# Altium project PBL4_2026L_runIT.PrjPcb (part 1 of 2)
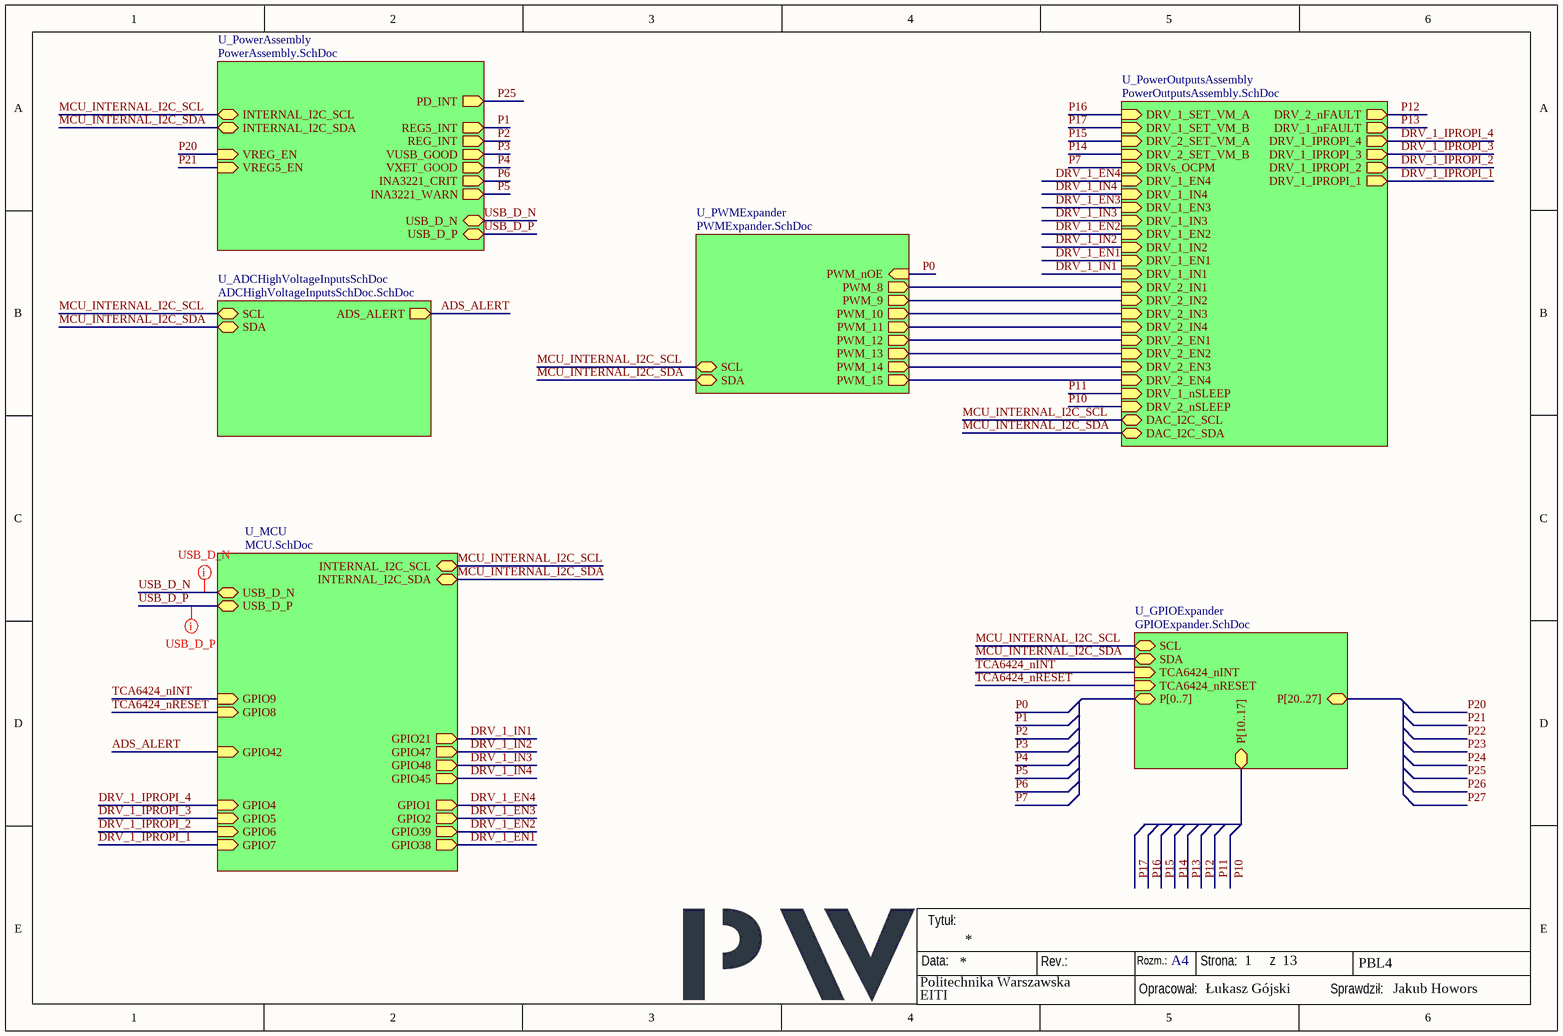
[diagram p0: MainAssembly.SchDoc]
projGroupName: grupa 3; projLocalName: runIT; projRevision: 1.0
13 sheets, 308 parts. Net scope: hierarchical (ports join the sheet entries above them; power ports are global).
Board file: PCB.PcbDoc
Sheets:
  MainAssembly.SchDoc
    U_PowerAssembly = PowerAssembly.SchDoc
      U_DCDC3 = DCDC3.SchDoc
      Reg = DCDCreg.SchDoc
      U_USBPD = USBPD.SchDoc
      Reg5 = DCDCreg.SchDoc
    U_PowerOutputsAssembly = PowerOutputsAssembly.SchDoc
      U_MuxVM_1 = MuxVM.SchDoc
      U_MuxVM_2 = MuxVM.SchDoc
      DRV1 = DRVPowerOutputs.SchDoc
      DRV2 = DRVPowerOutputs.SchDoc
      U_DAC = DAC.SchDoc
    U_PWMExpander = PWMExpander.SchDoc
    U_MCU = MCU.SchDoc
    U_ADCHighVoltageInputsSchDoc = ADCHighVoltageInputsSchDoc.SchDoc
    U_GPIOExpander = GPIOExpander.SchDoc

## Sheet MainAssembly.SchDoc
size 292 x 193 mm; CheckedBy: Jakub Howors; Author: Łukasz Gójski; CompanyName: Politechnika Warszawska; Organization: EITI; Address1: Nowowiejska 15/19; Address2: 00-665 Warszawa; Revision: 1.0; SheetNumber: 1; SheetTotal: 13; HTTPLink: www.pw.edu.pl; Group_Name: grupa 3; ProjName: runIT

### Sub-sheets
U_ADCHighVoltageInputsSchDoc = ADCHighVoltageInputsSchDoc.SchDoc: ADS_ALERT (out), SCL (bidir), SDA (bidir)
U_GPIOExpander = GPIOExpander.SchDoc: TCA6424_nINT (in), TCA6424_nRESET (in), P[0..7] (bidir), P[10..17] (bidir), P[20..27] (bidir), SCL (bidir), SDA (bidir)
U_MCU = MCU.SchDoc: INTERNAL_I2C_SCL (bidir), INTERNAL_I2C_SDA (bidir), GPIO2 (out), GPIO4 (in), GPIO5 (in), GPIO6 (in), GPIO7 (in), GPIO8 (in), GPIO21 (out), GPIO38 (out), GPIO47 (out), GPIO48 (out), GPIO45 (out), GPIO39 (out), USB_D_N (bidir), USB_D_P (bidir), GPIO1 (out), GPIO42 (in), GPIO9 (in)
U_PowerAssembly = PowerAssembly.SchDoc: REG5_INT (out), REG_INT (out), VUSB_GOOD (out), VXET_GOOD (out), INA3221_CRIT (out), INA3221_WARN (out), INTERNAL_I2C_SDA (bidir), INTERNAL_I2C_SCL (bidir), VREG_EN (in), VREG5_EN (in), USB_D_N (bidir), USB_D_P (bidir), PD_INT (out)
U_PowerOutputsAssembly = PowerOutputsAssembly.SchDoc: DRV_2_nFAULT (out), DRV_1_nFAULT (out), DRV_1_IPROPI_4 (out), DRV_1_IPROPI_3 (out), DRV_1_IPROPI_2 (out), DRV_1_IPROPI_1 (out), DRV_1_SET_VM_A (in), DRV_1_SET_VM_B (in), DRV_2_SET_VM_A (in), DRV_2_SET_VM_B (in), DRVs_OCPM (in), DRV_1_EN4 (in), DRV_1_IN4 (in), DRV_1_EN3 (in), DRV_1_IN3 (in), DRV_1_EN2 (in), DRV_1_IN2 (in), DRV_1_EN1 (in), DRV_1_IN1 (in), DRV_2_EN4 (in), DRV_2_IN4 (in), DRV_2_EN3 (in), DRV_2_IN3 (in), DRV_2_EN2 (in), DRV_2_IN2 (in), DRV_2_EN1 (in), DRV_2_IN1 (in), DRV_1_nSLEEP (in), DRV_2_nSLEEP (in), DAC_I2C_SCL (bidir), DAC_I2C_SDA (bidir)
U_PWMExpander = PWMExpander.SchDoc: SDA (bidir), SCL (bidir), PWM_nOE (in), PWM_8 (out), PWM_9 (out), PWM_10 (out), PWM_11 (out), PWM_12 (out), PWM_13 (out), PWM_14 (out), PWM_15 (out)

### Nets
ADS_ALERT: sheet U_MCU/GPIO42, sheet U_ADCHighVoltageInputsSchDoc/ADS_ALERT
DRV_1_EN1: sheet U_PowerOutputsAssembly/DRV_1_EN1, sheet U_MCU/GPIO38
DRV_1_EN2: sheet U_PowerOutputsAssembly/DRV_1_EN2, sheet U_MCU/GPIO39
DRV_1_EN3: sheet U_PowerOutputsAssembly/DRV_1_EN3, sheet U_MCU/GPIO2
DRV_1_EN4: sheet U_PowerOutputsAssembly/DRV_1_EN4, sheet U_MCU/GPIO1
DRV_1_IN1: sheet U_PowerOutputsAssembly/DRV_1_IN1, sheet U_MCU/GPIO21
DRV_1_IN2: sheet U_PowerOutputsAssembly/DRV_1_IN2, sheet U_MCU/GPIO47
DRV_1_IN3: sheet U_PowerOutputsAssembly/DRV_1_IN3, sheet U_MCU/GPIO48
DRV_1_IN4: sheet U_PowerOutputsAssembly/DRV_1_IN4, sheet U_MCU/GPIO45
DRV_1_IPROPI_1: sheet U_PowerOutputsAssembly/DRV_1_IPROPI_1, sheet U_MCU/GPIO7
DRV_1_IPROPI_2: sheet U_PowerOutputsAssembly/DRV_1_IPROPI_2, sheet U_MCU/GPIO6
DRV_1_IPROPI_3: sheet U_PowerOutputsAssembly/DRV_1_IPROPI_3, sheet U_MCU/GPIO5
DRV_1_IPROPI_4: sheet U_PowerOutputsAssembly/DRV_1_IPROPI_4, sheet U_MCU/GPIO4
DRV_2_EN1: sheet U_PowerOutputsAssembly/DRV_2_EN1, sheet U_PWMExpander/PWM_12
DRV_2_EN2: sheet U_PowerOutputsAssembly/DRV_2_EN2, sheet U_PWMExpander/PWM_13
DRV_2_EN3: sheet U_PowerOutputsAssembly/DRV_2_EN3, sheet U_PWMExpander/PWM_14
DRV_2_EN4: sheet U_PowerOutputsAssembly/DRV_2_EN4, sheet U_PWMExpander/PWM_15
DRV_2_IN1: sheet U_PowerOutputsAssembly/DRV_2_IN1, sheet U_PWMExpander/PWM_8
DRV_2_IN2: sheet U_PowerOutputsAssembly/DRV_2_IN2, sheet U_PWMExpander/PWM_9
DRV_2_IN3: sheet U_PowerOutputsAssembly/DRV_2_IN3, sheet U_PWMExpander/PWM_10
DRV_2_IN4: sheet U_PowerOutputsAssembly/DRV_2_IN4, sheet U_PWMExpander/PWM_11
MCU_INTERNAL_I2C_SCL: sheet U_PowerAssembly/INTERNAL_I2C_SCL, sheet U_PowerOutputsAssembly/DAC_I2C_SCL, sheet U_PWMExpander/SCL, sheet U_MCU/INTERNAL_I2C_SCL, sheet U_ADCHighVoltageInputsSchDoc/SCL, sheet U_GPIOExpander/SCL  [project net INTERNAL_I2C_SCL]
MCU_INTERNAL_I2C_SDA: sheet U_PowerAssembly/INTERNAL_I2C_SDA, sheet U_PowerOutputsAssembly/DAC_I2C_SDA, sheet U_PWMExpander/SDA, sheet U_MCU/INTERNAL_I2C_SDA, sheet U_ADCHighVoltageInputsSchDoc/SDA, sheet U_GPIOExpander/SDA  [project net INTERNAL_I2C_SDA]
TCA6424_nINT: sheet U_MCU/GPIO9, sheet U_GPIOExpander/TCA6424_nINT
TCA6424_nRESET: sheet U_MCU/GPIO8, sheet U_GPIOExpander/TCA6424_nRESET
USB_D_N: sheet U_PowerAssembly/USB_D_N, sheet U_MCU/USB_D_N
USB_D_P: sheet U_PowerAssembly/USB_D_P, sheet U_MCU/USB_D_P

### Layout directives
differential pair: USB_D_N, USB_D_P

### Notes on the sheet
- Data:
- Tytuł:
- Rev.:
- Rozm.:
- A4
- Strona:
- z
- PBL4
- Opracował:
- Sprawdził:

## Sheet PowerAssembly.SchDoc: Board Power Assembly
size 292 x 193 mm; CheckedBy: Jakub Howorus; Author: Łukasz Gójski; CompanyName: Politechnika Warszawska; DrawnBy: Łukasz Gójski; Organization: EITI; Address1: Nowowiejska 15/19; Address2: 00-665 Warszawa; Revision: 1.0; SheetNumber: 2; SheetTotal: 13; HTTPLink: www.pw.edu.pl; Group_Name: grupa 3; ProjName: runIT
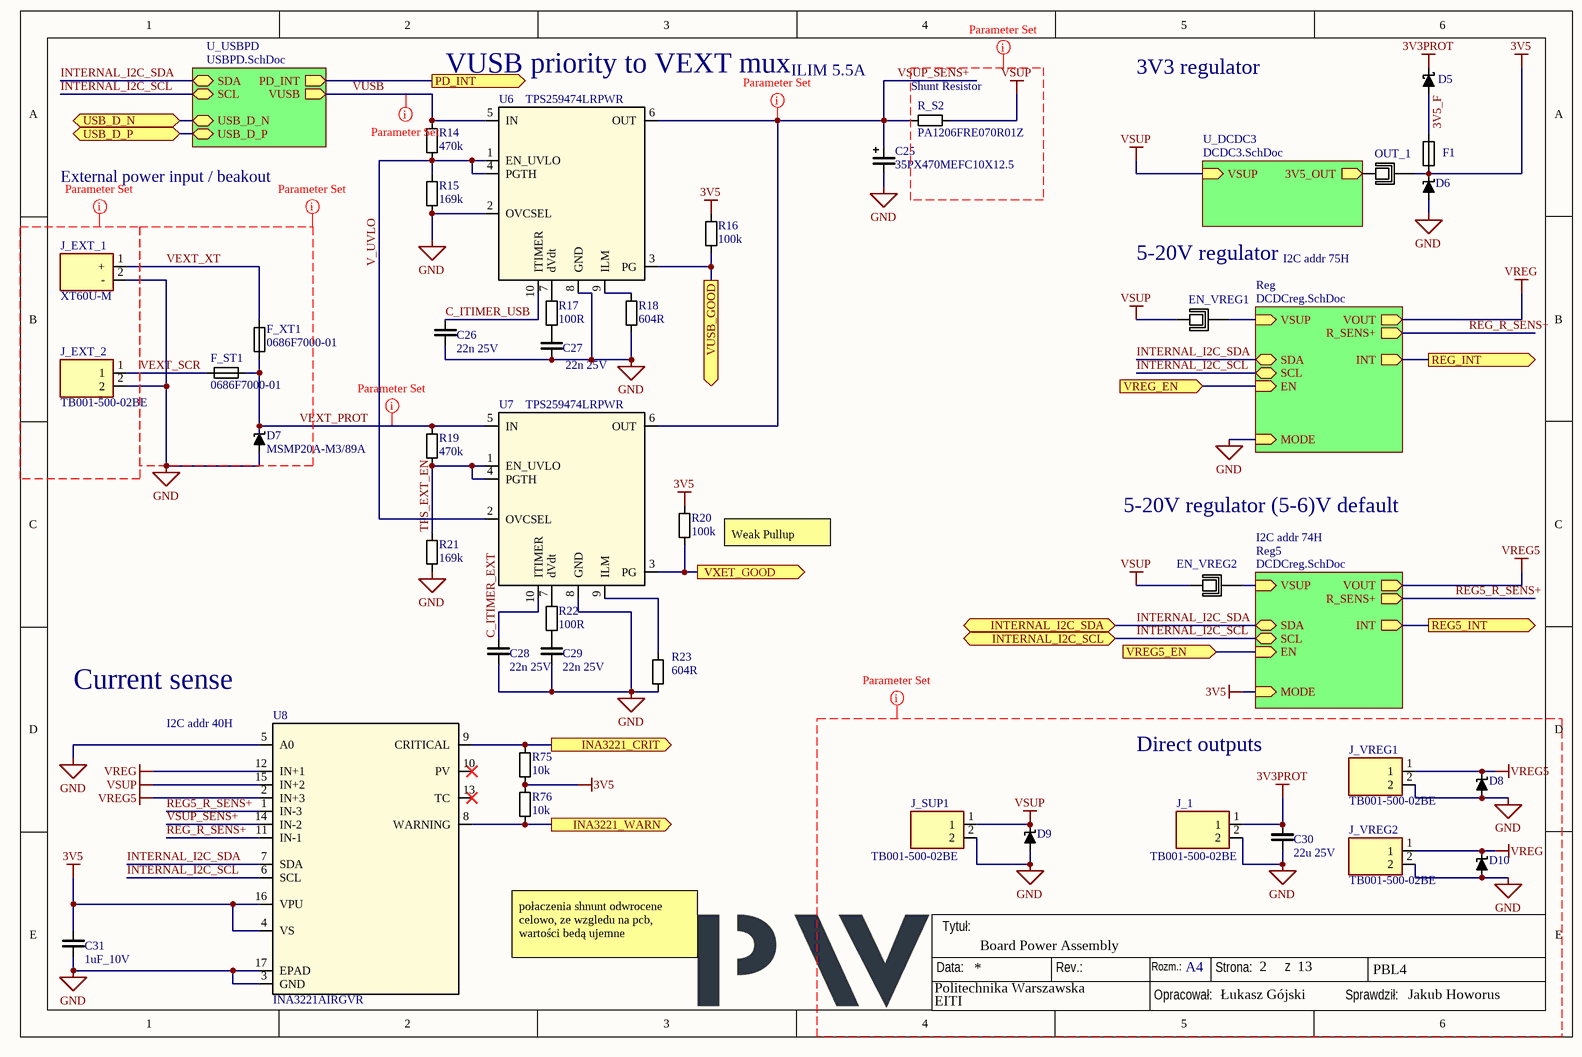
[diagram p1: PowerAssembly.SchDoc]

### Parts
C25  35PX470MEFC10X12.5  [CAP_PKPZ_10X12P5_LOW_RUB]
C26  22n 25V  [C_0603]
C27  22n 25V  [C_0603]
C28  22n 25V  [C_0603]
C29  22n 25V  [C_0603]
C30  22u 25V  [C_1206]
C31  1uF_10V  [C_0603]
D5  SL12-E3/61T  [DIONM5127X229N]  (value not drawn)
D6  MSMP20A-M3/89A  [CR_0A-M389A_VIS]  (value not drawn)
D7  MSMP20A-M3/89A  [CR_0A-M389A_VIS]
D8  MSMP20A-M3/89A  [CR_0A-M389A_VIS]  (value not drawn)
D9  MSMP20A-M3/89A  [CR_0A-M389A_VIS]  (value not drawn)
D10  MSMP20A-M3/89A  [CR_0A-M389A_VIS]  (value not drawn)
EN_VREG1  JUMPER  [Jumper]  (value not drawn)
EN_VREG2  JUMPER  [Jumper]  (value not drawn)
F1  SD110-08  [1812]  (value not drawn)
F_ST1  0686F7000-01  [0603_FUSE]
F_XT1  0686F7000-01  [0603_FUSE]
J_1  TB001-500-02BE  [TB00150002BE]
J_EXT_1  XT60U-M  [XT60U-M]
J_EXT_2  TB001-500-02BE  [TB00150002BE]
J_SUP1  TB001-500-02BE  [TB00150002BE]
J_VREG1  TB001-500-02BE  [TB00150002BE]
J_VREG2  TB001-500-02BE  [TB00150002BE]
OUT_1  JUMPER  [Jumper]  (value not drawn)
R14  470k  [R_0603]
R15  169k  [R_0603]
R16  100k  [R_0603]
R17  100R  [R_0603]
R18  604R  [R_0603]
R19  470k  [R_0603]
R20  100k  [R_0603]
R21  169k  [R_0603]
R22  100R  [R_0603]
R23  604R  [R_0603]
R75  10k  [R_0603]
R76  10k  [R_0603]
R_S2  PA1206FRE070R01Z  [R_1206]
U6  TPS259474LRPWR  [RPW0010A-MFG]
U7  TPS259474LRPWR  [RPW0010A-MFG]
U8  INA3221AIRGVR  [RGV16_2P16X2P16]

### Sub-sheets
Reg = DCDCreg.SchDoc: SDA (bidir), SCL (bidir), EN (in), VOUT (out), MODE (in), R_SENS+ (out), INT (out), VSUP (in)
Reg5 = DCDCreg.SchDoc: SDA (bidir), SCL (bidir), EN (in), VOUT (out), MODE (in), R_SENS+ (out), INT (out), VSUP (in)
U_DCDC3 = DCDC3.SchDoc: VSUP (in), 3V5_OUT (out)
U_USBPD = USBPD.SchDoc: PD_INT (out), SDA (bidir), SCL (bidir), VUSB (out), USB_D_N (bidir), USB_D_P (bidir)

### Ports
INA3221_CRIT (out, see MainAssembly[2A]), INA3221_WARN (out, see MainAssembly[2A]), INTERNAL_I2C_SCL (bidir, see MainAssembly[1A], MCU[6B]), INTERNAL_I2C_SDA (bidir, see MainAssembly[1A], MCU[6B]), PD_INT (out, see MainAssembly[2A], USBPD[4D]), REG5_INT (out, see MainAssembly[2A]), REG_INT (out, see MainAssembly[2A]), USB_D_N (bidir, see MainAssembly[2B], MCU[1A], USBPD[1D]), USB_D_P (bidir, see MainAssembly[2B], MCU[1B], USBPD[1D]), VREG5_EN (in, see MainAssembly[1A]), VREG_EN (in, see MainAssembly[1A]), VUSB_GOOD (out, see MainAssembly[2A]), VXET_GOOD (out, see MainAssembly[2A])

### Nets
3V3PROT: C30.2 D5.K J_1.1
3V5: C31.2 D6.K F1.2 OUT_1.2 R16.2 R20.2 R75.1 R76.2 U8.4(VS) U8.16(VPU) ; sheet Reg5/MODE
GND: C25.2 C26.1 C27.1 C28.1 C29.1 C30.1 C31.1 D6.A D7.A D8.A D9.A D10.A J_1.2 J_EXT_1.2(-) J_EXT_2.2 J_SUP1.2 J_VREG1.2 J_VREG2.2 R15.1 R18.1 R21.1 R23.1 U6.2(OVCSEL) U6.8(GND) U7.8(GND) U8.3(GND) U8.5(A0) U8.17(EPAD) ; sheet Reg/MODE
VREG: D10.K J_VREG2.1 U8.12(IN+1) ; sheet Reg/VOUT
VREG5: D8.K J_VREG1.1 U8.2(IN+3) ; sheet Reg5/VOUT
VSUP: D9.K EN_VREG1.1 EN_VREG2.1 J_SUP1.1 R_S2.2 U8.15(IN+2) ; sheet U_DCDC3/VSUP
3V5_F: D5.A F1.1
3V5_OUT: OUT_1.1 ; sheet U_DCDC3/3V5_OUT
C_ITIMER_EXT: C28.2 U7.10(ITIMER)
C_ITIMER_USB: C26.2 U6.10(ITIMER)
INT_3V: port PD_INT, sheet U_USBPD/PD_INT
INTERNAL_I2C_SCL: U8.6(SCL) ; port INTERNAL_I2C_SCL, sheet Reg/SCL, sheet U_USBPD/SCL, sheet Reg5/SCL
INTERNAL_I2C_SDA: U8.7(SDA) ; port INTERNAL_I2C_SDA, sheet Reg/SDA, sheet U_USBPD/SDA, sheet Reg5/SDA
P1: port REG5_INT, sheet Reg5/INT
P2: port REG_INT, sheet Reg/INT
P3: R16.1 U6.3(PG) ; port VUSB_GOOD
P4: R20.1 U7.3(PG) ; port VXET_GOOD
P5: R76.1 U8.8(WARNING) ; port INA3221_WARN
P6: R75.2 U8.9(CRITICAL) ; port INA3221_CRIT
P20: port VREG_EN, sheet Reg/EN
P21: port VREG5_EN, sheet Reg5/EN
REG5_R_SENS+: U8.1(IN-3) ; sheet Reg5/R_SENS+
REG_R_SENS+: U8.11(IN-1) ; sheet Reg/R_SENS+
TPS_EXT_EN: R19.1 R21.2 U7.1(EN_UVLO) U7.4(PGTH)
USB_D_N: port USB_D_N, sheet U_USBPD/USB_D_N
USB_D_P: port USB_D_P, sheet U_USBPD/USB_D_P
V_UVLO: R14.1 R15.2 U6.1(EN_UVLO) U6.4(PGTH) U7.2(OVCSEL)
VEXT_PROT: D7.K F_ST1.2 F_XT1.2 R19.2 U7.5(IN)
VEXT_SCR: F_ST1.1 J_EXT_2.1
VEXT_XT: F_XT1.1 J_EXT_1.1(+)
VSUP: EN_VREG1.2 ; sheet Reg/VSUP  [a separate net that carries the same name]
VSUP: EN_VREG2.2 ; sheet Reg5/VSUP  [a separate net that carries the same name]
VSUP_SENS+: C25.1 R_S2.1 U6.6(OUT) U7.6(OUT) U8.14(IN-2)
VUSB: R14.2 U6.5(IN) ; sheet U_USBPD/VUSB
NetC27_2: C27.2 R17.1
NetC29_2: C29.2 R22.1
NetR17_2: R17.2 U6.7(dVdt)
NetR18_2: R18.2 U6.9(ILM)
NetR22_2: R22.2 U7.7(dVdt)
NetR23_2: R23.2 U7.9(ILM)

Not connected (* = marked no-connect by the designer): U8 10(PV)* 13(TC)*

### Layout directives
CompClassName: NoRelief: GND, VEXT_PROT, VEXT_SCR, VEXT_XT, VSUP
CompClassName: NoRelief; net class NoRelief: VEXT_PROT, VSUP_SENS+, VUSB
CompClassName: ThickRelief: 3V3PROT, GND, VEXT_SCR, VREG, VREG5, VSUP

### Notes on the sheet
- VUSB priority to VEXT mux
- ILIM 5.5A
- (near R_S2) Shunt Resistor
- 3V3 regulator
- External power input / beakout
- (near EN_VREG1) 5-20V regulator
- I2C addr 75H
- 5-20V regulator (5-6)V default
- (near R20) Weak Pullup
- (near EN_VREG2) I2C addr 74H
- (near U8) Current sense
- (near U8) I2C addr 40H
- Direct outputs
- połaczenia shnunt odwrocene celowo, ze wzgledu na pcb, wartości bedą ujemne
- Data:
- Tytuł:
- Rev.:
- Rozm.:
- A4
- Strona:
- z
- PBL4
- Opracował:
- Sprawdził:

### Library data of the parts
C25 = C_Pol_470uF_35V: 470 µF 35 V Aluminum Electrolytic Capacitors Radial, Can 2000 Hrs @ 105°C; Manufacturer: Rubycon; Value: 470u; Voltage: 35V; Tolerance: 20%
C26-C29 = C_22nF_25V: Ceramic capacitor; Casing: 0603; Dielectric: X5R; Tolerance: 10%; Value: 22n; Voltage: 25V; Technology: Ceramic
C30 = C_22uF_25V: Ceramic capacitor; Casing: 1206; Dielectric: X7R; Tolerance: 20%; Value: 22u; Voltage: 25V; Technology: Ceramic
C31 = C_1uF_10V: Ceramic capacitor; Value: 1u; Voltage: 10V; Casing: 0603; Dielectric: X7R; Tolerance: 10%; Technology: Ceramic
D5 = D schottky 1.5A: Schottky Diode 1500mA 30V reverse; Casing: SMA (DO-214AC); Reverse standoff voltage: 20V; VFm: 380mV@1000mA
D6-D10 = TVS_22V: 22V Breakdown MSMP20A-M3/89A; ComponentLink1Description: Datasheet; ComponentLink1URL: https://www.bourns.com/docs/product-datasheets/smbj.pdf; ComponentLink2Description: Supplier; ComponentLink2URL: https://www.mouser.pl/ProductDetail/Bourns/SMBJ22A?qs=%252Bf8Cd6aE5bxYX21zv65pDQ%3D%3D; Value: 22V
EN_VREG1 EN_VREG2 OUT_1 = Jumper x2: Jumper on traces
F1 = PTC 1.1A FUSE: FUSE PTC 1.1A 8VDC 2.2A TRIP
F_ST1 F_XT1 = F_7A: 7A fuse 0603 package; Manufacturer: Bel fuse Inc.; Current: 7A
J_1 J_EXT_2 J_SUP1 J_VREG1 J_VREG2 = Screw Terminal x2 5mm: Screw terminal x2 5mm spacing; Manufacturer: Same Sky; MP: TB001-500-02BE
J_EXT_1 = XT60: XT60 male connector, ewentualnie dostępny w zasobach prywatnych (5szt); Manufacturer: AMASS
R14 R19 = R_470k: Resistor; Tolerance: 1%; Power: 100mW; Casing: 0603; Value: 470k
R15 R21 = R_169k: Resistor; Tolerance: 1%; Power: 100mW; Casing: 0603; Value: 169k
R16 R20 = R_100k: Resistor; Tolerance: 1%; Power: 100mW; Casing: 0603; Value: 100k
R17 R22 = R_100R: Resistor; Tolerance: 1%; Power: 100mW; Casing: 0603; Value: 100R
R18 R23 = R_604R: Resistor; Tolerance: 1%; Power: 100mW; Casing: 0603; Value: 604R
R75 R76 = R_10k: Resistor; Tolerance: 1%; Power: 100mW; Casing: 0603; Value: 10k
R_S2 = R_10mR: Shunt Resistor 10 mR, 1206, 250mW; Value: 10mR; Tolerance: 1%; Casing: 1206; Power: 250mW
U6 U7 = TPS259474LRPWR: 2.7-V to 23-V, 5.5-A eFuse with integrated reverse polarity protection 10-VQFN-HR; Manufacturer: Texas Instruments; Manufacturer_Part_Number: TPS259474LRPWR
U8 = INA3221AIRGVR: 26V, triple channel, 13-bit, i2c output current/voltage monitor w/alerts 16-VQFN; Manufacturer: Texas Instruments; Manufacturer_Part_Number: INA3221AIRGVR; Datasheet: https://www.ti.com/lit/gpn/ina3221

## Sheet DCDC3.SchDoc: Buck 3.5V
size 292 x 193 mm; CheckedBy: Jakub Howors; Author: Łukasz Gójski; CompanyName: Politechnika Warszawska; Organization: EITI; Address1: Nowowiejska 15/19; Address2: 00-665 Warszawa; Revision: 1.0; SheetNumber: 5; SheetTotal: 13; HTTPLink: www.pw.edu.pl; Group_Name: grupa 3; ProjName: runIT
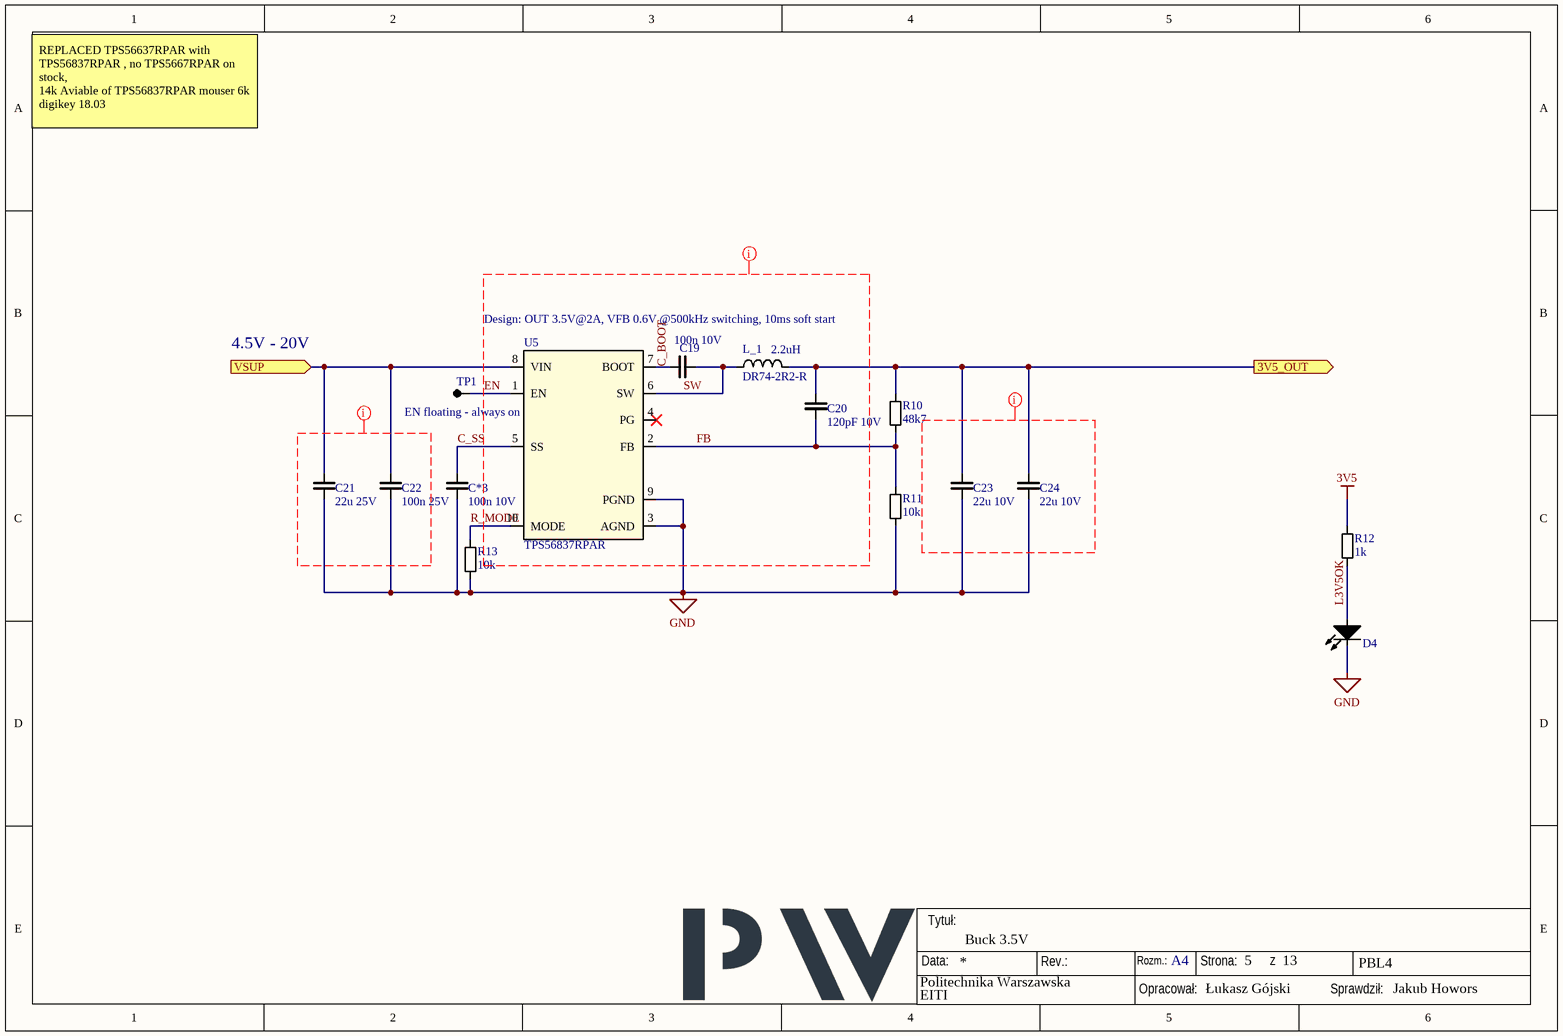
[diagram p2: DCDC3.SchDoc]

### Parts
C19  100n 10V  [C_0603]
C20  120pF 10V  [C_0603]
C21  22u 25V  [C_1206]
C22  100n 25V  [C_0603]
C23  22u 10V  [C_1206]
C24  22u 10V  [C_1206]
C*3  100n 10V  [C_0603]
D4  RED  [LED_0603]  (value not drawn)
L_1  DR74-2R2-R  [DR74-2R2-R]
R10  48k7  [R_0603]
R11  10k  [R_0603]
R12  1k  [R_0603]
R13  10k  [R_0603]
TP1  TP  [TP]  (value not drawn)
U5  TPS56837RPAR  [RPA0010A-MFG]

### Ports
3V5_OUT (out, see PowerAssembly[6A]), VSUP (in, see PowerAssembly[5A])

### Nets
3V5: R12.2
GND: C21.1 C22.1 C23.1 C24.1 C*3.1 D4.K R11.1 R13.1 U5.3(AGND) U5.9(PGND)
VSUP: C21.2 C22.2 U5.8(VIN) ; port VSUP
3V5_OUT: C20.2 C23.2 C24.2 L_1.2 R10.2 ; port 3V5_OUT
C_BOOT: C19.2 U5.7(BOOT)
C_SS: C*3.2 U5.5(SS)
EN: TP1.1(TP) U5.1(EN)
FB: C20.1 R10.1 R11.2 U5.2(FB)
L3V5OK: D4.A R12.1
R_MODE: R13.2 U5.10(MODE)
SW: C19.1 L_1.1 U5.6(SW)

Not connected (* = marked no-connect by the designer): U5 4(PG)*

### Layout directives
CompClassName: NoRelief: (no net found under the mark), C_BOOT, EN, FB, SW

### Notes on the sheet
- REPLACED TPS56637RPAR with TPS56837RPAR , no TPS5667RPAR on stock,
  14k Aviable of TPS56837RPAR mouser 6k digikey 18.03
- 4.5V - 20V
- Design: OUT 3.5V@2A, VFB 0.6V @500kHz switching, 10ms soft start
- (near L_1) 2.2uH
- (near U5) EN floating - always on
- Data:
- Tytuł:
- Rev.:
- Rozm.:
- A4
- Strona:
- z
- PBL4
- Opracował:
- Sprawdził:

### Library data of the parts
C19 C*3 = C_100nF_10V: Ceramic capacitor; Casing: 0603; Dielectric: X7R; Tolerance: 10%; Value: 100n; Voltage: 10V; Technology: Ceramic
C20 = C_120pF_10V: Ceramic capacitor; Value: 120p; Casing: 0603; Dielectric: XR7; Tolerance: 10%; Voltage: 10V; Technology: Ceramic
C21 = C_22uF_25V: as C30 on sheet PowerAssembly; Value: 22u; Voltage: 25V; Technology: Ceramic
C22 = C_100nF_25V: Ceramic capacitor; Casing: 0603; Dielectric: X7R; Tolerance: 10%; Value: 100n; Voltage: 25V; Technology: Ceramic
C23 C24 = C_22uF_10V: Ceramic capacitor; Casing: 1206; Dielectric: X5R; Tolerance: 20%; Value: 22u; Voltage: 10V; Technology: Ceramic
D4 = LED_0603: LED RED 0603 3.3V; Casing: 0603; Color: RED
L_1 = L_2u2_4.76A_1: Inductor, 2.2uF 4.76A; Manufacturer: EATON ELECTRONICS; Value: 2u2; Tolerance: 20%; IDC: 7.06A; ComponentLink1Description: Datasheet; ComponentLink1URL: https://www.eaton.com/content/dam/eaton/products/electronic-components/resources/data-sheet/eaton-dr-high-power-density-high-efficiency-shielded-drum-core-power-inductors-data-sheet.pdf; ComponentLink2Description: Supplier; ComponentLink2URL: https://www.digikey.pl/pl/products/detail/eaton-electronics-division/DR74-2R2-R/667219
R10 = R_48k7: Resistor; Tolerance: 1%; Power: 100mW; Casing: 0603; Value: 48k7
R11 R13 = R_10k: as R75 on sheet PowerAssembly; Value: 10k
R12 = R_1k: Resistor; Tolerance: 1%; Power: 100mW; Casing: 0603; Value: 1k
U5 = TPS56837RPAR: Switching Voltage Regulators 4.5-V to 28-V input 8-A synchronous buck; Manufacturer: Texas Instruments; Manufacturer_Part_Number: TPS56837RPAR

## Sheet DCDCreg.SchDoc: Regulated Buck-Boost I2C
size 292 x 193 mm; CheckedBy: Jakub Howors; Author: Łukasz Gójski; CompanyName: Politechnika Warszawska; Organization: EITI; Address1: Nowowiejska 15/19; Address2: 00-665 Warszawa; Revision: 1.0; SheetNumber: 4; SheetTotal: 13; HTTPLink: www.pw.edu.pl; Group_Name: grupa 3; ProjName: runIT
Used 2 times, as channels U_PowerAssembly/Reg, U_PowerAssembly/Reg5. Parts and nets are listed once, with the designators drawn on the sheet.
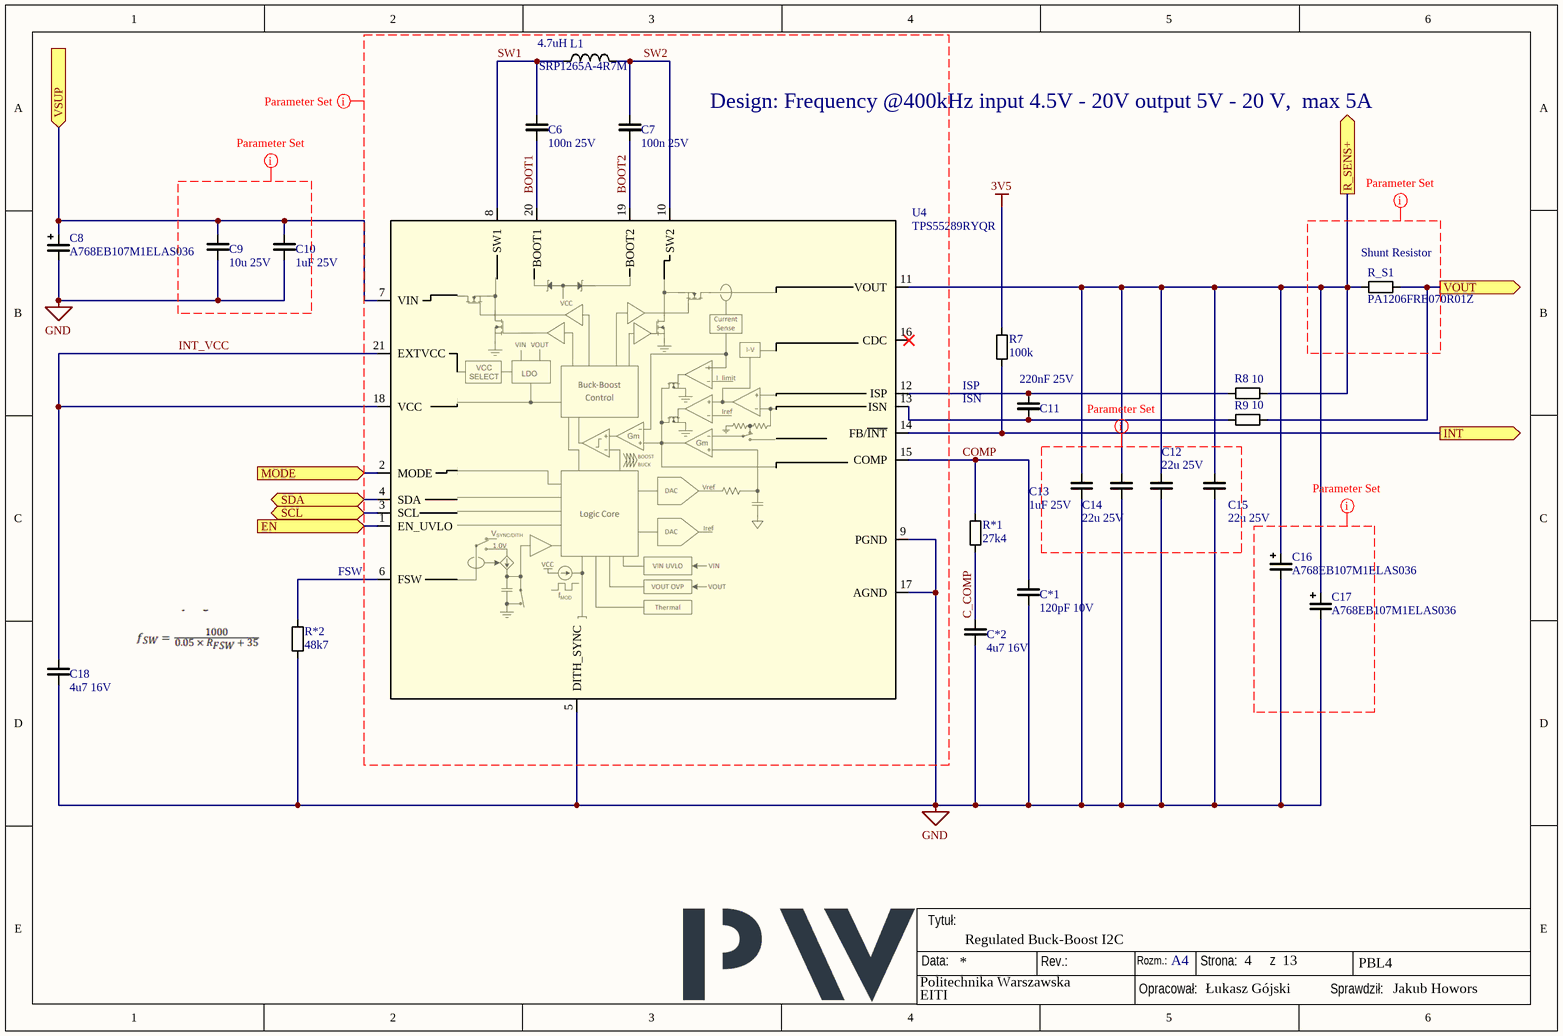
[diagram p3: DCDCreg.SchDoc]

### Parts
C6  100n 25V  [C_0603]
C7  100n 25V  [C_0603]
C8  A768EB107M1ELAS036  [CAP_A768EB_6.8x6.8_KEM]
C9  10u 25V  [C_0805]
C10  1uF 25V  [C_0603]
C11  220nF 25V  [C_0603]
C12  22u 25V  [C_1206]
C13  1uF 25V  [C_0603]
C14  22u 25V  [C_1206]
C15  22u 25V  [C_1206]
C16  A768EB107M1ELAS036  [CAP_A768EB_6.8x6.8_KEM]
C17  A768EB107M1ELAS036  [CAP_A768EB_6.8x6.8_KEM]
C18  4u7 16V  [C_0603]
C*1  120pF 10V  [C_0603]
C*2  4u7 16V  [C_0603]
L1  SRP1265A-4R7M  [SRP1265A-4R7M]
R7  100k  [R_0603]
R8  10  [R_0603]
R9  10  [R_0603]
R*1  27k4  [R_0603]
R*2  48k7  [R_0603]
R_S1  PA1206FRE070R01Z  [R_1206]
U4  TPS55289RYQR  [RYQ0021A-MFG]

### Ports
EN (in, see PowerAssembly[5B]), INT (out, see PowerAssembly[6B]), MODE (in, see PowerAssembly[5C]), R_SENS+ (out, see PowerAssembly[6B]), SCL (bidir, see PowerAssembly[5B], ADCHighVoltageInputsSchDoc[2A], DAC[3C], GPIOExpander[2B], PWMExpander[2B], USBPD[4C]), SDA (bidir, see PowerAssembly[5B], ADCHighVoltageInputsSchDoc[2A], DAC[3C], GPIOExpander[2B], PWMExpander[2A], USBPD[4C]), VOUT (out, see PowerAssembly[6B]), VSUP (in, see PowerAssembly[5B])

### Nets
3V5: R7.2
GND: C8.2 C9.1 C10.1 C12.1 C13.1 C14.1 C15.1 C16.2 C17.2 C18.1 C*1.1 C*2.1 R*2.1 U4.5(DITH_SYNC) U4.9(PGND) U4.17(AGND)
BOOT1: C6.1 U4.20(BOOT1)
BOOT2: C7.1 U4.19(BOOT2)
C_COMP: C*2.2 R*1.1
COMP: C*1.2 R*1.2 U4.15(COMP)
EN: U4.1(EN_UVLO) ; port EN
INT: R7.1 U4.14(FB/~{INT}) ; port INT
INT_VCC: C18.2 U4.18(VCC) U4.21(EXTVCC)
MODE: U4.2(MODE) ; port MODE
R_SENS+: C12.2 C13.2 C14.2 C15.2 C16.1 C17.1 R8.1 R_S1.1 U4.11(VOUT) ; port R_SENS+
SCL: U4.3(SCL) ; port SCL
SDA: U4.4(SDA) ; port SDA
SW1: C6.2 L1.1 U4.8(SW1)
SW2: C7.2 L1.2 U4.10(SW2)
VOUT: R9.1 R_S1.2 ; port VOUT
VSUP: C8.1 C9.2 C10.2 U4.7(VIN) ; port VSUP
NetC11_1: C11.1 R9.2 U4.13(ISN)
NetC11_2: C11.2 R8.2 U4.12(ISP)
NetR*2_2: R*2.2 U4.6(FSW)

Not connected (* = marked no-connect by the designer): U4 16(CDC)*

### Channels
U_PowerAssembly/Reg: designators end in A; ports EN=P20 INT=P2 MODE=GND R_SENS+=REG_R_SENS+ SCL=INTERNAL_I2C_SCL SDA=INTERNAL_I2C_SDA VOUT=VREG VSUP=VSUP
U_PowerAssembly/Reg5: designators end in B; ports EN=P21 INT=P1 MODE=3V5 R_SENS+=REG5_R_SENS+ SCL=INTERNAL_I2C_SCL SDA=INTERNAL_I2C_SDA VOUT=VREG5 VSUP=VSUP

### Layout directives
CompClassName: NoRelief: (no net found under the mark), BOOT1, BOOT2, REG_R_SENS+, SW1, SW2
CompClassName: ThickRelief: (no net found under the mark)

### Notes on the sheet
- (near L1) 4.7uH
- Design: Frequency @400kHz input 4.5V - 20V output 5V - 20 V,  max 5A
- (near R_S1) Shunt Resistor
- (near R7) ISP
- ISN
- (near U4) FSW
- Data:
- Tytuł:
- Rev.:
- Rozm.:
- A4
- Strona:
- z
- PBL4
- Opracował:
- Sprawdził:

### Library data of the parts
C6 C7 = C_100nF_25V: as C22 on sheet DCDC3; Value: 100n; Voltage: 25V; Technology: Ceramic
C8 C16 C17 = C_Pol_100uF_25V: Aluminum Organic Polymer Capacitors 25Vol 100uF SMD 2KHr ESR=36 mOhms AECQ200; Manufacturer: KEMET; Voltage: 25V; Tolerance: 20%; Value: 100uF; ComponentLink1Description: Datasheet; ComponentLink1URL: https://yageogroup.com/content/datasheet/asset/file/KEM_A4088_A768; ComponentLink2Description: Supplier; ComponentLink2URL: https://www.digikey.pl/pl/products/detail/kemet/A768EB107M1ELAS036/13420071
C9 = C_10uF_25V: Ceramic capacitor; Casing: 0805; Dielectric: X5R; Tolerance: 10%; Value: 10u; Voltage: 25V; Technology: Ceramic
C10 C13 = C_1uF_25V: Ceramic capacitor; Value: 1u; Casing: 0603; Dielectric: XR7; Tolerance: 10%; Voltage: 25V; Technology: Ceramic
C11 = C_220nF_25V: Ceramic capacitor; Value: 220n; Casing: 0603; Dielectric: XR7; Tolerance: 10%; Voltage: 25V; Technology: Ceramic
C12 C14 C15 = C_22uF_25V: as C30 on sheet PowerAssembly; Value: 22u; Voltage: 25V; Technology: Ceramic
C18 C*2 = C_4u7_16V: Ceramic capacitor; Casing: 0603; Dielectric: X5R; Tolerance: 10%; Value: 4u7; Voltage: 16V; Technology: Ceramic
C*1 = C_120pF_10V: as C20 on sheet DCDC3; Voltage: 10V; Technology: Ceramic
L1 = L_4u7_10.5A: Inductor, 4.7 uF , 10A; Manufacturer: Bourns Inc.; Value: 4u7; Tolerance: 20%; IDC: 10A
R7 = R_100k: as R16 on sheet PowerAssembly; Value: 100k
R8 R9 = R_10R: Tolerance: 1%; Power: 100mW; Casing: 0603; Value: 10
R*1 = R_27k4: Resistor; Tolerance: 1%; Power: 100mW; Casing: 0603; Value: 27k4
R*2 = R_48k7: as R10 on sheet DCDC3; Value: 48k7
R_S1 = R_10mR: as R_S2 on sheet PowerAssembly; Power: 250mW
U4 = TPS55289RYQR: 30-V, 8-A buck-boost converter with I2C interface; Manufacturer: Texas Instruments; Manufacturer_Part_Number: TPS55289RYQR; ComponentLink1Description: Datasheet; ComponentLink1URL: https://www.ti.com/lit/ds/symlink/tps55289.pdf; ComponentLink2Description: Supplier; ComponentLink2URL: https://www.digikey.pl/pl/products/detail/texas-instruments/TPS55289RYQR/16928303?s=N4IgTCBcDaIC4AcDOBWFYAcBOASgTwEcAnEAXQF8g; ComponentLink3Description: Supplier; ComponentLink3URL: https://www.mouser.pl/ProductDetail/Texas-Instruments/TPS55289RYQR?qs=T%252BzbugeAwjhgaIN94Lbpjg%3D%3D&utm_id=20109199562&utm_source=google&utm_medium=cpc&utm_marketing_tactic=emeacorp

## Sheet USBPD.SchDoc: USB PD negotiator
size 292 x 193 mm; CheckedBy: Jakub Howors; Author: Łukasz Gójski; CompanyName: Politechnika Warszawska; DrawnBy: Łukasz Gójski; Organization: EITI; Address1: Nowowiejska 15/19; Address2: 00-665 Warszawa; Revision: 1.0; SheetNumber: 3; SheetTotal: 13; NazwaPliku: USBPD; HTTPLink: www.pw.edu.pl; Group_Name: grupa 3; ProjName: runIT
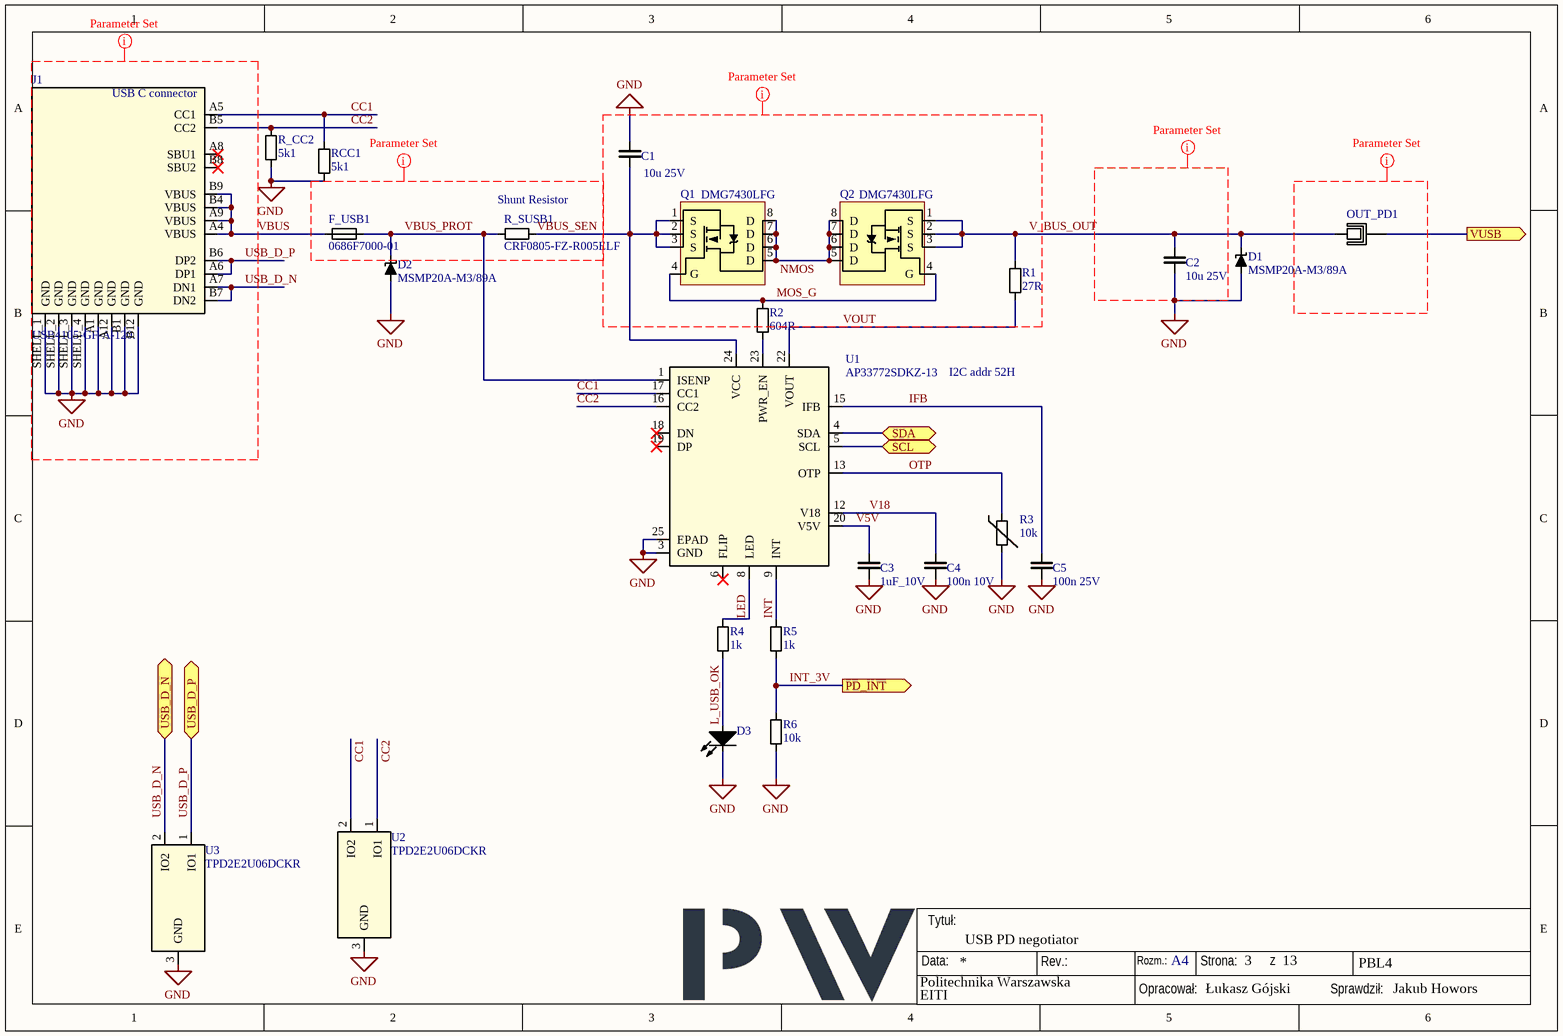
[diagram p4: USBPD.SchDoc]

### Parts
C1  10u 25V  [C_0805]
C2  10u 25V  [C_0805]
C3  1uF_10V  [C_0603]
C4  100n 10V  [C_0603]
C5  100n 25V  [C_0603]
D1  MSMP20A-M3/89A  [CR_0A-M389A_VIS]
D2  MSMP20A-M3/89A  [CR_0A-M389A_VIS]
D3  RED  [LED_0603]  (value not drawn)
F_USB1  0686F7000-01  [0603_FUSE]
J1  USB4105-GF-A-120.  [CONN_USB4105-xx-A-xxx_GCT]
OUT_PD1  JUMPER  [Jumper]  (value not drawn)
Q1  DMG7430LFG  [PowerDI3333-8]
Q2  DMG7430LFG  [PowerDI3333-8]
R1  27R  [R_0603]
R2  604R  [R_0603]
R3  10k  [R_0603]
R4  1k  [R_0603]
R5  1k  [R_0603]
R6  10k  [R_0603]
R_CC2  5k1  [R_0603]
R_SUSB1  CRF0805-FZ-R005ELF  [R_0805]
RCC1  5k1  [R_0603]
U1  AP33772SDKZ-13  [W-QFN4040-24_Type_A1_DIO-M]
U2  TPD2E2U06DCKR  [DCK0003A-MFG]
U3  TPD2E2U06DCKR  [DCK0003A-MFG]

### Ports
PD_INT (out, see PowerAssembly[2A]), SCL (bidir, see PowerAssembly[1A], ADCHighVoltageInputsSchDoc[2A], DAC[3C], DCDCreg[2C], GPIOExpander[2B], PWMExpander[2B]), SDA (bidir, see PowerAssembly[1A], ADCHighVoltageInputsSchDoc[2A], DAC[3C], DCDCreg[2C], GPIOExpander[2B], PWMExpander[2A]), USB_D_N (bidir, see PowerAssembly[1A], MCU[1A], PowerAssembly[1A]), USB_D_P (bidir, see PowerAssembly[1A], MCU[1B], PowerAssembly[1A]), VUSB (out, see PowerAssembly[2A])

### Nets
GND: C1.2 C2.1 C3.1 C4.1 C5.1 D1.A D2.A D3.K J1.A1(GND) J1.A12(GND) J1.B1(GND) J1.B12(GND) J1.SHELL_1(GND) J1.SHELL_2(GND) J1.SHELL_3(GND) J1.SHELL_4(GND) R3.1 R6.1 R_CC2.1 RCC1.1 U1.3(GND) U1.25(EPAD) U2.3(GND) U3.3(GND)
CC1: J1.A5(CC1) RCC1.2 U1.17(CC1) U2.2(IO2)
CC2: J1.B5(CC2) R_CC2.2 U1.16(CC2) U2.1(IO1)
IFB: C5.2 U1.15(IFB)
INT: R5.2 U1.9(INT)
INT_3V: R5.1 R6.2 ; port PD_INT
INTERNAL_I2C_SCL: U1.5(SCL) ; port SCL
INTERNAL_I2C_SDA: U1.4(SDA) ; port SDA
L_USB_OK: D3.A R4.1
LED: R4.2 U1.8(LED)
MOS_G: Q1.4(G) Q2.4(G) R2.2
NMOS: Q1.5(D) Q1.6(D) Q1.7(D) Q1.8(D) Q2.5(D) Q2.6(D) Q2.7(D) Q2.8(D)
OTP: R3.2 U1.13(OTP)
USB_D_N: J1.A7(DN1) J1.B7(DN2) U3.2(IO2) ; port USB_D_N
USB_D_P: J1.A6(DP1) J1.B6(DP2) U3.1(IO1) ; port USB_D_P
V5V: C3.2 U1.20(V5V)
V18: C4.2 U1.12(V18)
V_BUS_OUT: C2.2 D1.K OUT_PD1.1 Q2.1(S) Q2.2(S) Q2.3(S) R1.2
VBUS: F_USB1.1 J1.A4(VBUS) J1.A9(VBUS) J1.B4(VBUS) J1.B9(VBUS)
VBUS_PROT: D2.K F_USB1.2 R_SUSB1.1 U1.1(ISENP)
VBUS_SEN: C1.1 Q1.1(S) Q1.2(S) Q1.3(S) R_SUSB1.2 U1.24(VCC)
VOUT: R1.1 U1.22(VOUT)
VUSB: OUT_PD1.2 ; port VUSB
NetR2_1: R2.1 U1.23(PWR_EN)

Not connected (* = marked no-connect by the designer): J1 A8(SBU1)* B8(SBU2)*; U1 2(NC) 6(FLIP)* 7(NC) 10(NC) 11(NC) 14(NC) 18(DN)* 19(DP)* 21(NC)

### Layout directives
CompClassName: NoRelief: (no net found under the mark), GND, MOS_G, NMOS, USB_D_N, USB_D_P, V_BUS_OUT, VBUS, VBUS_PROT, VBUS_SEN, VOUT

### Notes on the sheet
- (near R_SUSB1) Shunt Resistor
- I2C addr 52H
- Data:
- Tytuł:
- Rev.:
- Rozm.:
- A4
- Strona:
- z
- PBL4
- Opracował:
- Sprawdził:
- (in symbol USB4105-GF-A-120.) USB C connector

### Library data of the parts
C1 C2 = C_10uF_25V: as C9 on sheet DCDCreg; Value: 10u; Voltage: 25V; Technology: Ceramic
C3 = C_1uF_10V: as C31 on sheet PowerAssembly; Technology: Ceramic
C4 = C_100nF_10V: as C19 on sheet DCDC3; Value: 100n; Voltage: 10V; Technology: Ceramic
C5 = C_100nF_25V: as C22 on sheet DCDC3; Value: 100n; Voltage: 25V; Technology: Ceramic
D1 D2 = TVS_22V: 22V Breakdown MSMP20A-M3/89A; ComponentLink1Description: Datasheet; ComponentLink1URL: https://www.bourns.com/docs/product-datasheets/smbj.pdf; ComponentLink2Description: Supplier; ComponentLink2URL: https://www.mouser.pl/ProductDetail/Bourns/SMBJ22A?qs=%252Bf8Cd6aE5bxYX21zv65pDQ%3D%3D; Value: 22V
D3 = LED_0603: LED RED 0603 3.3V; Casing: 0603; Color: RED
F_USB1 = F_7A: as F_ST1 on sheet PowerAssembly; Current: 7A
J1 = USB4105-GF-A-120.: USB - C connector  16 pin, 100W, famale paraller to board; pin to pad: SHELL_1>17 SHELL_2>18 SHELL_3>19 SHELL_4>20; Manufacturer: Global Connector Technology; Manufacturer_Part_Number: USB4105-GF-A-120.; Power: 100W
OUT_PD1 = Jumper x2: Jumper on traces
Q1 Q2 = NMOS_DMG7430LFG: DMG7430LFG, N-mosfet; Manufacturer: Diodes Incorporated; Casing: 8-PowerVDFN
R1 = R_27R: Resistor; Tolerance: 1%; Power: 100mW; Casing: 0603; Value: 27R
R2 = R_604R: as R18 on sheet PowerAssembly; Value: 604R
R3 = R_NTC_10k_25C: NTC Thermistor, 10k; Casing: 0603; Tolerance: 1%; Value: 10k
R4 R5 = R_1k: as R12 on sheet DCDC3; Value: 1k
R6 = R_10k: as R75 on sheet PowerAssembly; Value: 10k
R_CC2 RCC1 = R_5k1: Resistor; Tolerance: 1%; Power: 100mW; Casing: 0603; Value: 5k1
R_SUSB1 = R_5mR: Shunt Resistor 5mR, 0805; Tolerance: 1%; Power: 500mW; Casing: 0805; Value: 5mR
U1 = AP33772SDKZ-13: USB_C PD controller; Manufacturer: Diodes Inc; Manufacturer_Part_Number: AP33772SDKZ-13
U2 U3 = TPD2E2U06DCKR: Dual 1.5-pF, 5.5-V, ±25-kV  ESD protection diode with 5.5-A 8/20-uS surge rating  for USB 2.0 3-SC70; Manufacturer: Texas Instruments; Manufacturer_Part_Number: TPD2E2U06DCKR

## Sheet PowerOutputsAssembly.SchDoc: Power Outputs Assembly
size 292 x 193 mm; CheckedBy: Jakub Howors; Author: Łukasz Gójski; CompanyName: Politechnika Warszawska; Organization: EITI; Address1: Nowowiejska 15/19; Address2: 00-665 Warszawa; Revision: 1.0; SheetNumber: 10; SheetTotal: 13; HTTPLink: www.pw.edu.pl; Group_Name: grupa 3; ProjName: runIT
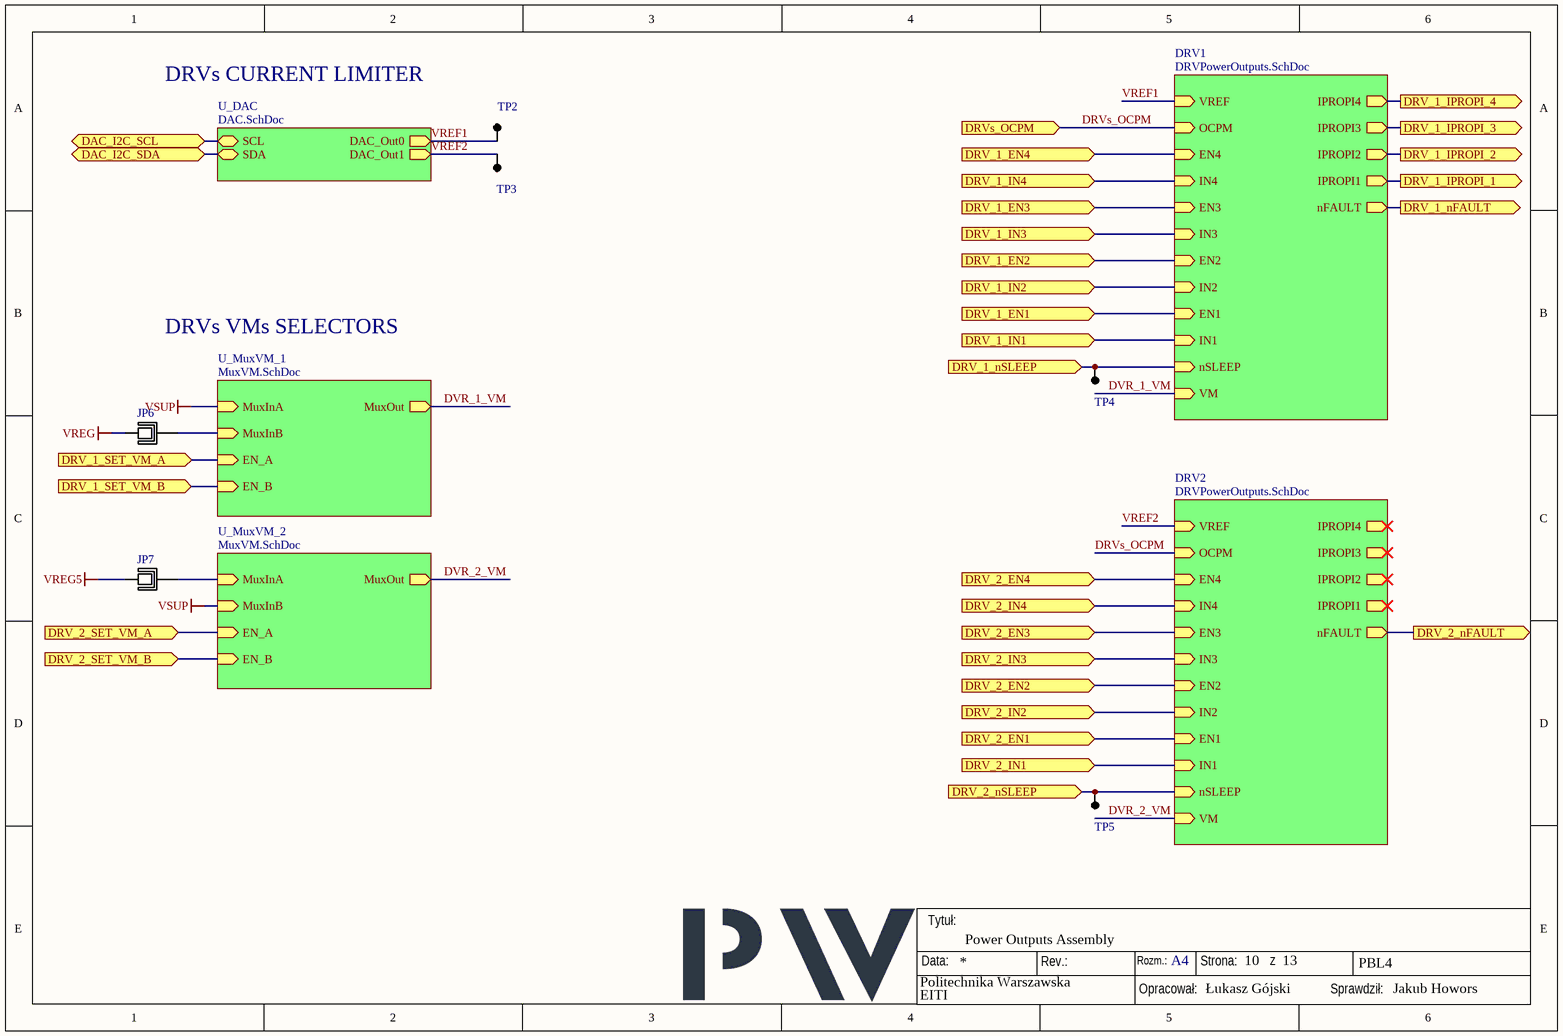
[diagram p5: PowerOutputsAssembly.SchDoc]

### Parts
JP6  JUMPER  [Jumper]  (value not drawn)
JP7  JUMPER  [Jumper]  (value not drawn)
TP2  TP  [TP]  (value not drawn)
TP3  TP  [TP]  (value not drawn)
TP4  TP  [TP]  (value not drawn)
TP5  TP  [TP]  (value not drawn)

### Sub-sheets
DRV1 = DRVPowerOutputs.SchDoc: VREF (in), OCPM (in), IPROPI4 (out), IPROPI3 (out), IPROPI2 (out), IPROPI1 (out), EN4 (in), IN4 (in), EN3 (in), IN3 (in), EN2 (in), IN2 (in), EN1 (in), IN1 (in), nSLEEP (in), nFAULT (out), VM (in)
DRV2 = DRVPowerOutputs.SchDoc: VREF (in), OCPM (in), IPROPI4 (out), IPROPI3 (out), IPROPI2 (out), IPROPI1 (out), EN4 (in), IN4 (in), EN3 (in), IN3 (in), EN2 (in), IN2 (in), EN1 (in), IN1 (in), nSLEEP (in), nFAULT (out), VM (in)
U_DAC = DAC.SchDoc: DAC_Out0 (out), DAC_Out1 (out), SCL (bidir), SDA (bidir)
U_MuxVM_1 = MuxVM.SchDoc: MuxOut (out), MuxInA (in), MuxInB (in), EN_A (in), EN_B (in)
U_MuxVM_2 = MuxVM.SchDoc: MuxOut (out), MuxInA (in), MuxInB (in), EN_A (in), EN_B (in)

### Ports
DAC_I2C_SCL (bidir, see MainAssembly[5C]), DAC_I2C_SDA (bidir, see MainAssembly[5C]), DRV_1_EN1 (in, see MainAssembly[5B]), DRV_1_EN2 (in, see MainAssembly[5B]), DRV_1_EN3 (in, see MainAssembly[5A]), DRV_1_EN4 (in, see MainAssembly[5A]), DRV_1_IN1 (in, see MainAssembly[5B]), DRV_1_IN2 (in, see MainAssembly[5B]), DRV_1_IN3 (in, see MainAssembly[5B]), DRV_1_IN4 (in, see MainAssembly[5A]), DRV_1_IPROPI_1 (out, see MainAssembly[6A]), DRV_1_IPROPI_2 (out, see MainAssembly[6A]), DRV_1_IPROPI_3 (out, see MainAssembly[6A]), DRV_1_IPROPI_4 (out, see MainAssembly[6A]), DRV_1_nFAULT (out, see MainAssembly[6A]), DRV_1_nSLEEP (in, see MainAssembly[5B]), DRV_1_SET_VM_A (in, see MainAssembly[5A]), DRV_1_SET_VM_B (in, see MainAssembly[5A]), DRV_2_EN1 (in, see MainAssembly[5B]), DRV_2_EN2 (in, see MainAssembly[5B]), DRV_2_EN3 (in, see MainAssembly[5B]), DRV_2_EN4 (in, see MainAssembly[5B]), DRV_2_IN1 (in, see MainAssembly[5B]), DRV_2_IN2 (in, see MainAssembly[5B]), DRV_2_IN3 (in, see MainAssembly[5B]), DRV_2_IN4 (in, see MainAssembly[5B]), DRV_2_nFAULT (out, see MainAssembly[6A]), DRV_2_nSLEEP (in, see MainAssembly[5B]), DRV_2_SET_VM_A (in, see MainAssembly[5A]), DRV_2_SET_VM_B (in, see MainAssembly[5A]), DRVs_OCPM (in, see MainAssembly[5A])

### Nets
VREG: JP6.1
VREG5: JP7.1
VSUP: sheet U_MuxVM_1/MuxInA, sheet U_MuxVM_2/MuxInB
DRV_1_EN1: port DRV_1_EN1, sheet DRV1/EN1
DRV_1_EN2: port DRV_1_EN2, sheet DRV1/EN2
DRV_1_EN3: port DRV_1_EN3, sheet DRV1/EN3
DRV_1_EN4: port DRV_1_EN4, sheet DRV1/EN4
DRV_1_IN1: port DRV_1_IN1, sheet DRV1/IN1
DRV_1_IN2: port DRV_1_IN2, sheet DRV1/IN2
DRV_1_IN3: port DRV_1_IN3, sheet DRV1/IN3
DRV_1_IN4: port DRV_1_IN4, sheet DRV1/IN4
DRV_1_IPROPI_1: port DRV_1_IPROPI_1, sheet DRV1/IPROPI1
DRV_1_IPROPI_2: port DRV_1_IPROPI_2, sheet DRV1/IPROPI2
DRV_1_IPROPI_3: port DRV_1_IPROPI_3, sheet DRV1/IPROPI3
DRV_1_IPROPI_4: port DRV_1_IPROPI_4, sheet DRV1/IPROPI4
DRV_2_EN1: port DRV_2_EN1, sheet DRV2/EN1
DRV_2_EN2: port DRV_2_EN2, sheet DRV2/EN2
DRV_2_EN3: port DRV_2_EN3, sheet DRV2/EN3
DRV_2_EN4: port DRV_2_EN4, sheet DRV2/EN4
DRV_2_IN1: port DRV_2_IN1, sheet DRV2/IN1
DRV_2_IN2: port DRV_2_IN2, sheet DRV2/IN2
DRV_2_IN3: port DRV_2_IN3, sheet DRV2/IN3
DRV_2_IN4: port DRV_2_IN4, sheet DRV2/IN4
DRVs_OCPM: port DRVs_OCPM, sheet DRV1/OCPM, sheet DRV2/OCPM
DVR_1_VM: sheet U_MuxVM_1/MuxOut, sheet DRV1/VM
DVR_2_VM: sheet U_MuxVM_2/MuxOut, sheet DRV2/VM
INTERNAL_I2C_SCL: port DAC_I2C_SCL, sheet U_DAC/SCL
INTERNAL_I2C_SDA: port DAC_I2C_SDA, sheet U_DAC/SDA
MuxInA: JP7.2 ; sheet U_MuxVM_2/MuxInA
MuxInB: JP6.2 ; sheet U_MuxVM_1/MuxInB
P10: TP5.1(TP) ; port DRV_2_nSLEEP, sheet DRV2/nSLEEP
P11: TP4.1(TP) ; port DRV_1_nSLEEP, sheet DRV1/nSLEEP
P12: port DRV_2_nFAULT, sheet DRV2/nFAULT
P13: port DRV_1_nFAULT, sheet DRV1/nFAULT
P14: port DRV_2_SET_VM_B, sheet U_MuxVM_2/EN_B
P15: port DRV_2_SET_VM_A, sheet U_MuxVM_2/EN_A
P16: port DRV_1_SET_VM_A, sheet U_MuxVM_1/EN_A
P17: port DRV_1_SET_VM_B, sheet U_MuxVM_1/EN_B
VREF1: TP2.1(TP) ; sheet DRV1/VREF, sheet U_DAC/DAC_Out0
VREF2: TP3.1(TP) ; sheet DRV2/VREF, sheet U_DAC/DAC_Out1

### Notes on the sheet
- DRVs CURRENT LIMITER
- DRVs VMs SELECTORS
- Data:
- Tytuł:
- Rev.:
- Rozm.:
- A4
- Strona:
- z
- PBL4
- Opracował:
- Sprawdził:

### Library data of the parts
JP6 JP7 = Jumper x2: Jumper on traces

## Sheet MuxVM.SchDoc: Power Outputs Voltage Source Selector
size 292 x 193 mm; CheckedBy: Łukasz Gójski; Author: Jakub Howors; CompanyName: Politechnika Warszawska; Organization: EITI; Address1: Nowowiejska 15/19; Address2: 00-665 Warszawa; Revision: 1.0; SheetNumber: 12; SheetTotal: 13; HTTPLink: www.pw.edu.pl; Group_Name: grupa 3; ProjName: runIT
Used 2 times, as channels U_PowerOutputsAssembly/U_MuxVM_1, U_PowerOutputsAssembly/U_MuxVM_2. Parts and nets are listed once, with the designators drawn on the sheet.
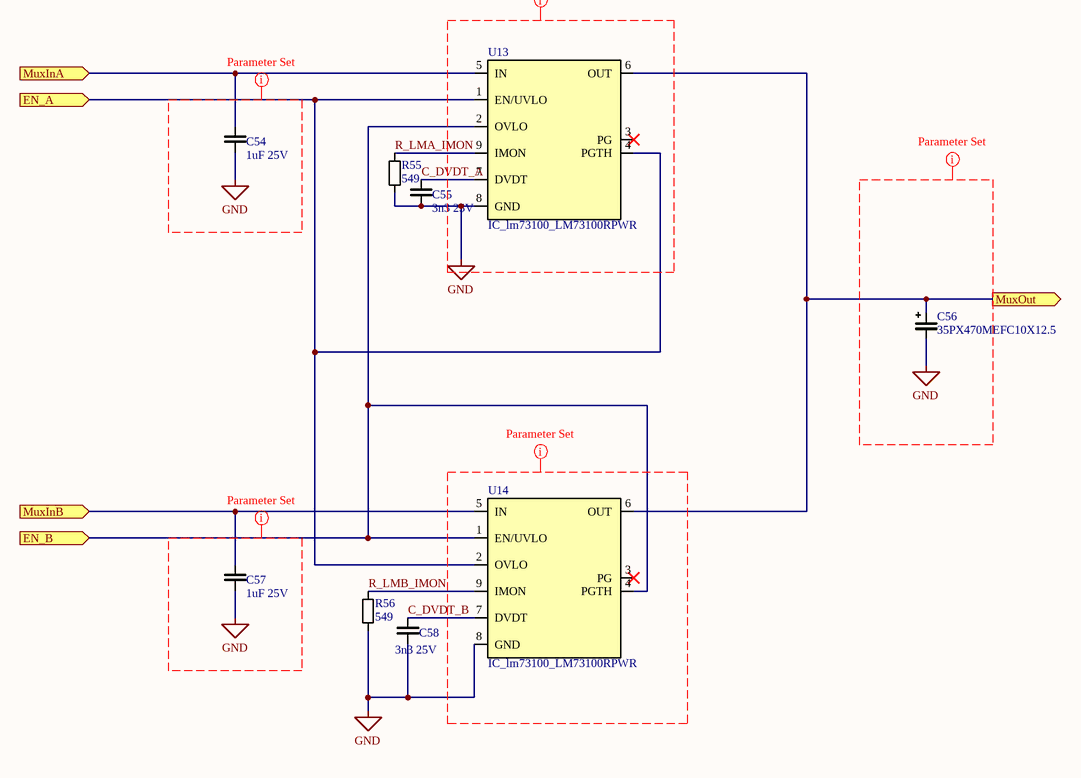
[diagram p6: MuxVM.SchDoc]

### Parts
C54  1uF 25V  [C_0603]
C55  3n3 25V  [C_0603]
C56  35PX470MEFC10X12.5  [CAP_PKPZ_10X12P5_LOW_RUB]
C57  1uF 25V  [C_0603]
C58  3n3 25V  [C_0603]
R55  549  [R_0603]
R56  549  [R_0603]
U13  IC_lm73100_LM73100RPWR  [LM73100_RPW0010A]
U14  IC_lm73100_LM73100RPWR  [LM73100_RPW0010A]

### Ports
EN_A (in, see PowerOutputsAssembly[1C]), EN_B (in, see PowerOutputsAssembly[1C]), MuxInA (in, see PowerOutputsAssembly[1B]), MuxInB (in, see PowerOutputsAssembly[1C]), MuxOut (out, see PowerOutputsAssembly[2B])

### Nets
GND: C54.1 C55.1 C56.2 C57.1 C58.1 R55.2 R56.2 U13.8(GND) U14.8(GND)
C_DVDT_A: C55.2 U13.7(DVDT)
C_DVDT_B: C58.2 U14.7(DVDT)
EN_A: U13.1(EN/UVLO) U13.4(PGTH) U14.2(OVLO) ; port EN_A
EN_B: U13.2(OVLO) U14.1(EN/UVLO) U14.4(PGTH) ; port EN_B
MuxInA: C54.2 U13.5(IN) ; port MuxInA
MuxInB: C57.2 U14.5(IN) ; port MuxInB
MuxOut: C56.1 U13.6(OUT) U14.6(OUT) ; port MuxOut
R_LMA_IMON: R55.1 U13.9(IMON)
R_LMB_IMON: R56.1 U14.9(IMON)

Not connected (* = marked no-connect by the designer): U13 3(PG)* 10(DNC); U14 3(PG)* 10(DNC)

### Channels
U_PowerOutputsAssembly/U_MuxVM_1: designators end in A; ports EN_A=P16 EN_B=P17 MuxInA=VSUP MuxInB=MuxInB MuxOut=DVR_1_VM
U_PowerOutputsAssembly/U_MuxVM_2: designators end in B; ports EN_A=P15 EN_B=P14 MuxInA=MuxInA MuxInB=VSUP MuxOut=DVR_2_VM

### Layout directives
CompClassName: NoRelief: (no net found under the mark), GND, P16, P17
CompClassName: ThickRelief: GND

### Notes on the sheet
- Data:
- Tytuł:
- Rev.:
- Rozm.:
- A4
- Strona:
- z
- PBL4
- Opracował:
- Sprawdził:

### Library data of the parts
C54 C57 = C_1uF_25V: as C10 on sheet DCDCreg; Voltage: 25V; Technology: Ceramic
C55 C58 = C_3n3F_25V: Ceramic capacitor; Casing: 0603; Dielectric: XR7; Tolerance: 10%; Value: 3n3; Voltage: 25V; Technology: Ceramic
C56 = C_Pol_470uF_35V: as C25 on sheet PowerAssembly
R55 R56 = R_549: Tolerance: 1%; Power: 100mW; Casing: 0603; Value: 549
U13 U14 = IC_lm73100_LM73100RPWR: Ideal diode ORing controller 5.5A 23V; Manufacturer: Texas Instruments

## Sheet DRVPowerOutputs.SchDoc
size 292 x 193 mm; CheckedBy: Łukasz Gójski; Author: Jakub Howors; CompanyName: Politechnika Warszawska; Organization: EITI; Address1: Nowowiejska 15/19; Address2: 00-665 Warszawa; Revision: 1.0; SheetNumber: 11; SheetTotal: 13; HTTPLink: www.pw.edu.pl; Group_Name: grupa 3; ProjName: runIT
Used 2 times, as channels U_PowerOutputsAssembly/DRV1, U_PowerOutputsAssembly/DRV2. Parts and nets are listed once, with the designators drawn on the sheet.
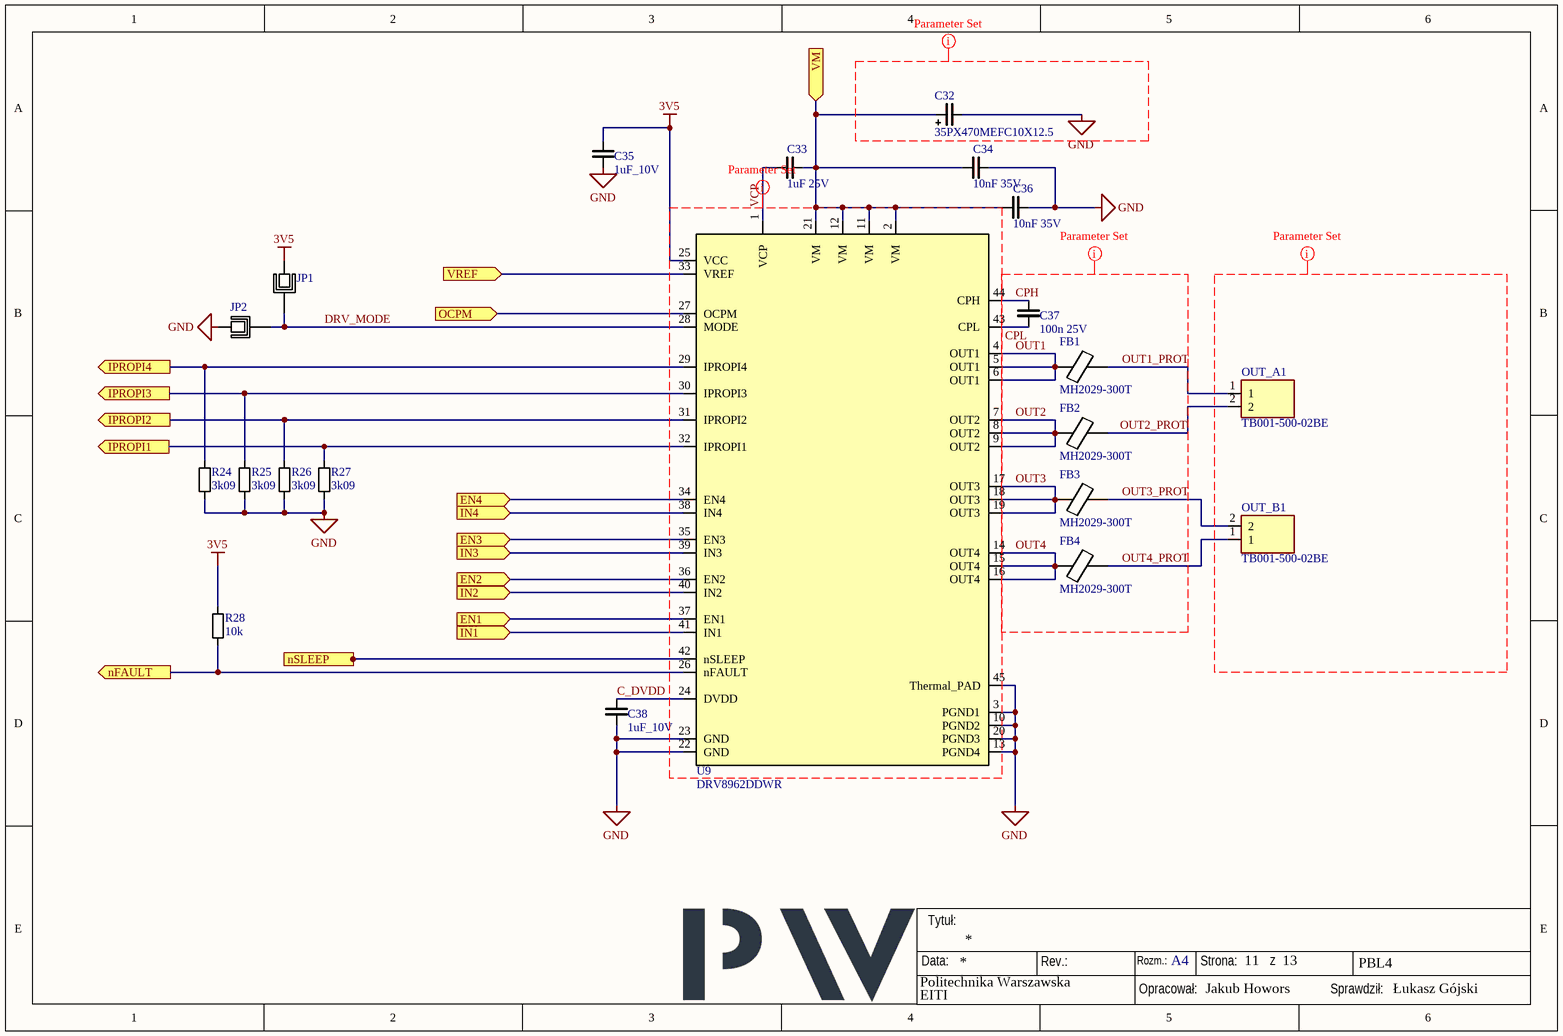
[diagram p7: DRVPowerOutputs.SchDoc]

### Parts
C32  35PX470MEFC10X12.5  [CAP_PKPZ_10X12P5_LOW_RUB]
C33  1uF 25V  [C_0603]
C34  10nF 35V  [0603_CAP]
C35  1uF_10V  [C_0603]
C36  10nF 35V  [0603_CAP]
C37  100n 25V  [C_0603]
C38  1uF_10V  [C_0603]
FB1  MH2029-300T  [MH2029-300T]
FB2  MH2029-300T  [MH2029-300T]
FB3  MH2029-300T  [MH2029-300T]
FB4  MH2029-300T  [MH2029-300T]
JP1  JUMPER  [Jumper]  (value not drawn)
JP2  JUMPER  [Jumper]  (value not drawn)
OUT_A1  TB001-500-02BE  [TB00150002BE]
OUT_B1  TB001-500-02BE  [TB00150002BE]
R24  3k09  [R_0603]
R25  3k09  [R_0603]
R26  3k09  [R_0603]
R27  3k09  [R_0603]
R28  10k  [R_0603]
U9  DRV8962DDWR  [DDW0044E-MFG]

### Ports
EN1 (in, see PowerOutputsAssembly[5B]), EN2 (in, see PowerOutputsAssembly[5B]), EN3 (in, see PowerOutputsAssembly[5A]), EN4 (in, see PowerOutputsAssembly[5A]), IN1 (in, see PowerOutputsAssembly[5B]), IN2 (in, see PowerOutputsAssembly[5B]), IN3 (in, see PowerOutputsAssembly[5B]), IN4 (in, see PowerOutputsAssembly[5A]), IPROPI1 (out, see PowerOutputsAssembly[6A]), IPROPI2 (out, see PowerOutputsAssembly[6A]), IPROPI3 (out, see PowerOutputsAssembly[6A]), IPROPI4 (out, see PowerOutputsAssembly[6A]), nFAULT (out, see PowerOutputsAssembly[6A]), nSLEEP (in, see PowerOutputsAssembly[5B]), OCPM (in, see PowerOutputsAssembly[5A]), VM (in, see PowerOutputsAssembly[5B]), VREF (in, see PowerOutputsAssembly[5A])

### Nets
3V5: C35.2 JP1.1 R28.1 U9.25(VCC)
GND: C32.2 C34.2 C35.1 C36.2 C38.1 JP2.1 R24.1 R25.1 R26.1 R27.1 U9.3(PGND1) U9.10(PGND2) U9.13(PGND4) U9.20(PGND3) U9.22(GND) U9.23(GND) U9.45(Thermal_PAD)
C_DVDD: C38.2 U9.24(DVDD)
CPH: C37.2 U9.44(CPH)
CPL: C37.1 U9.43(CPL)
DRV_MODE: JP1.2 JP2.2 U9.28(MODE)
EN1: U9.37(EN1) ; port EN1
EN2: U9.36(EN2) ; port EN2
EN3: U9.35(EN3) ; port EN3
EN4: U9.34(EN4) ; port EN4
IN1: U9.41(IN1) ; port IN1
IN2: U9.40(IN2) ; port IN2
IN3: U9.39(IN3) ; port IN3
IN4: U9.38(IN4) ; port IN4
IPROPI1: R27.2 U9.32(IPROPI1) ; port IPROPI1
IPROPI2: R26.2 U9.31(IPROPI2) ; port IPROPI2
IPROPI3: R25.2 U9.30(IPROPI3) ; port IPROPI3
IPROPI4: R24.2 U9.29(IPROPI4) ; port IPROPI4
nFAULT: R28.2 U9.26(nFAULT) ; port nFAULT
nSLEEP: U9.42(nSLEEP) ; port nSLEEP
OCPM: U9.27(OCPM) ; port OCPM
OUT1: FB1.1 U9.4(OUT1) U9.5(OUT1) U9.6(OUT1)
OUT1_PROT: FB1.2 OUT_A1.1
OUT2: FB2.1 U9.7(OUT2) U9.8(OUT2) U9.9(OUT2)
OUT2_PROT: FB2.2 OUT_A1.2
OUT3: FB3.1 U9.17(OUT3) U9.18(OUT3) U9.19(OUT3)
OUT3_PROT: FB3.2 OUT_B1.2
OUT4: FB4.1 U9.14(OUT4) U9.15(OUT4) U9.16(OUT4)
OUT4_PROT: FB4.2 OUT_B1.1
VCP: C33.1 U9.1(VCP)
VM: C32.1 C33.2 C34.1 C36.1 U9.2(VM) U9.11(VM) U9.12(VM) U9.21(VM) ; port VM
VREF: U9.33(VREF) ; port VREF

### Channels
U_PowerOutputsAssembly/DRV1: designators end in A; ports EN1=DRV_1_EN1 EN2=DRV_1_EN2 EN3=DRV_1_EN3 EN4=DRV_1_EN4 IN1=DRV_1_IN1 IN2=DRV_1_IN2 IN3=DRV_1_IN3 IN4=DRV_1_IN4 IPROPI1=DRV_1_IPROPI_1 IPROPI2=DRV_1_IPROPI_2 IPROPI3=DRV_1_IPROPI_3 IPROPI4=DRV_1_IPROPI_4 nFAULT=P13 nSLEEP=P11 OCPM=DRVs_OCPM VM=DVR_1_VM VREF=VREF1
U_PowerOutputsAssembly/DRV2: designators end in B; ports EN1=DRV_2_EN1 EN2=DRV_2_EN2 EN3=DRV_2_EN3 EN4=DRV_2_EN4 IN1=DRV_2_IN1 IN2=DRV_2_IN2 IN3=DRV_2_IN3 IN4=DRV_2_IN4 IPROPI1=IPROPI1_DRV2 IPROPI2=IPROPI2_DRV2 IPROPI3=IPROPI3_DRV2 IPROPI4=IPROPI4_DRV2 nFAULT=P12 nSLEEP=P10 OCPM=DRVs_OCPM VM=DVR_2_VM VREF=VREF2

### Layout directives
CompClassName: NoRelief: CPH, CPL, OUT1, OUT1_PROT, OUT2, OUT2_PROT, OUT3, OUT3_PROT, OUT4, OUT4_PROT, VCP_DRV1
CompClassName: ThickRelief: (no net found under the mark), GND

### Notes on the sheet
- Data:
- Tytuł:
- Rev.:
- Rozm.:
- A4
- Strona:
- z
- PBL4
- Opracował:
- Sprawdził:

### Library data of the parts
C32 = C_Pol_470uF_35V: as C25 on sheet PowerAssembly
C33 = C_1uF_25V: as C10 on sheet DCDCreg; Voltage: 25V; Technology: Ceramic
C34 C36 = Cap_10nF: Ceramic capacitor; Casing: 0603; Tolerance: 5%; Dielectric: X7R; Value: 10nF; Voltage: 35V
C35 C38 = C_1uF_10V: as C31 on sheet PowerAssembly; Technology: Ceramic
C37 = C_100nF_25V: as C22 on sheet DCDC3; Value: 100n; Voltage: 25V; Technology: Ceramic
FB1-FB4 = FerriteBead_8A5: Ferrite bead; Manufacturer: Bourns Inc.
JP1 JP2 = Jumper x2: Jumper on traces
OUT_A1 OUT_B1 = Screw Terminal x2 5mm: as J_1 on sheet PowerAssembly; MP: TB001-500-02BE
R24-R27 = R_3k09: Resistor; Tolerance: 1%; Power: 100mW; Casing: 0603; Value: 3k09
R28 = R_10k: as R75 on sheet PowerAssembly; Value: 10k
U9 = IC_drv8962_PDRV8962DDWR: 65-V four-channel half-bridge driver with current sense outputs 44-HTSSOP; Manufacturer: Texas Instruments; Manufacturer_Part_Number: DRV8962DDWR

## Sheet DAC.SchDoc: DAC for DRVs Current Limiting
size 292 x 193 mm; CheckedBy: Łukasz Gójski; Author: Jakub Howorus; CompanyName: Politechnika Warszawska; DrawnBy: Jakub Howorus; Organization: EITI; Address1: Nowowiejska 15/19; Address2: 00-665 Warszawa; Revision: 1.0; SheetNumber: 13; SheetTotal: 13; HTTPLink: www.pw.edu.pl; Group_Name: grupa 3; ProjName: runIT
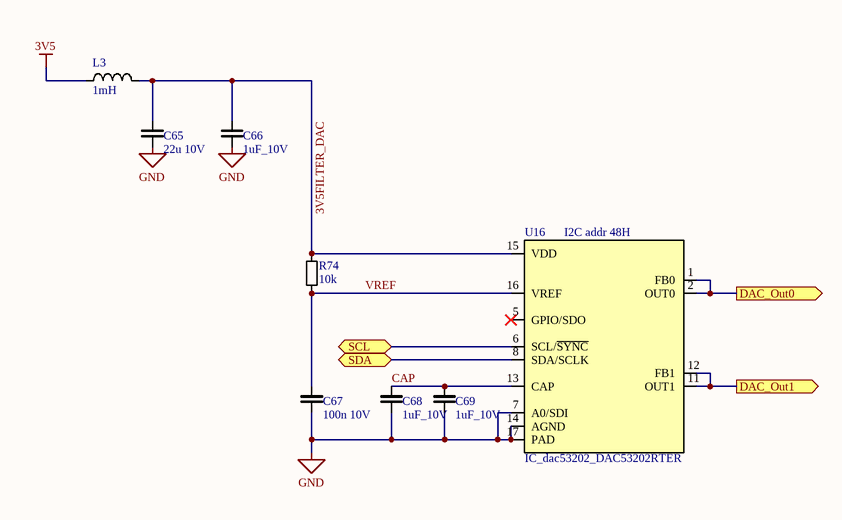
[diagram p8: DAC.SchDoc]

### Parts
C65  22u 10V  [C_1206]
C66  1uF_10V  [C_0603]
C67  100n 10V  [C_0603]
C68  1uF_10V  [C_0603]
C69  1uF_10V  [C_0603]
L3  1mH  [L_1007]
R74  10k  [R_0603]
U16  IC_dac53202_DAC53202RTER  [DAC53202_RTE0016C]

### Ports
DAC_Out0 (out, see PowerOutputsAssembly[2A]), DAC_Out1 (out, see PowerOutputsAssembly[2A]), SCL (bidir, see PowerOutputsAssembly[1A], ADCHighVoltageInputsSchDoc[2A], DCDCreg[2C], GPIOExpander[2B], PWMExpander[2B], USBPD[4C]), SDA (bidir, see PowerOutputsAssembly[1A], ADCHighVoltageInputsSchDoc[2A], DCDCreg[2C], GPIOExpander[2B], PWMExpander[2A], USBPD[4C])

### Nets
3V5: L3.1
GND: C65.1 C66.1 C67.1 C68.1 C69.1 U16.7(A0/SDI) U16.14(AGND) U16.17(PAD)
3V5FILTER_DAC: C65.2 C66.2 L3.2 R74.2 U16.15(VDD)
CAP: C68.2 C69.2 U16.13(CAP)
INTERNAL_I2C_SCL: U16.6(SCL/~{SYNC}) ; port SCL
INTERNAL_I2C_SDA: U16.8(SDA/SCLK) ; port SDA
VREF: C67.2 R74.1 U16.16(VREF)
VREF1: U16.1(FB0) U16.2(OUT0) ; port DAC_Out0
VREF2: U16.11(OUT1) U16.12(FB1) ; port DAC_Out1

Not connected (* = marked no-connect by the designer): U16 3(NC) 4(NC) 5(GPIO/SDO)* 9(NC) 10(NC)

### Notes on the sheet
- (near U16) I2C addr 48H
- Data:
- Tytuł:
- Rev.:
- Rozm.:
- A4
- Strona:
- z
- PBL4
- Opracował:
- Sprawdził:

### Library data of the parts
C65 = C_22uF_10V: as C23 on sheet DCDC3; Value: 22u; Voltage: 10V; Technology: Ceramic
C66 C68 C69 = C_1uF_10V: as C31 on sheet PowerAssembly; Technology: Ceramic
C67 = C_100nF_10V: as C19 on sheet DCDC3; Value: 100n; Voltage: 10V; Technology: Ceramic
L3 = L_1mH: Inductor; Casing: 1007; Tolerance: 20%; Idc: 15mA; Value: 1mH
R74 = R_10k: as R75 on sheet PowerAssembly; Value: 10k
U16 = IC_dac53202_DAC53202RTER: DAC53202RTER; Manufacturer: Texas Instruments

## Sheet PWMExpander.SchDoc: PWM Expander
size 292 x 193 mm; CheckedBy: Łukasz Gójski; CompanyName: Politechnika Warszawska; Organization: EITI; Address1: Nowowiejska 15/19; Address2: 00-665 Warszawa; Revision: 1.0; SheetNumber: 6; SheetTotal: 13; NazwaPliku: PWM expander; FileName: PWM expander; HTTPLink: www.pw.edu.pl; Group_Name: grupa 3; ProjName: runIT
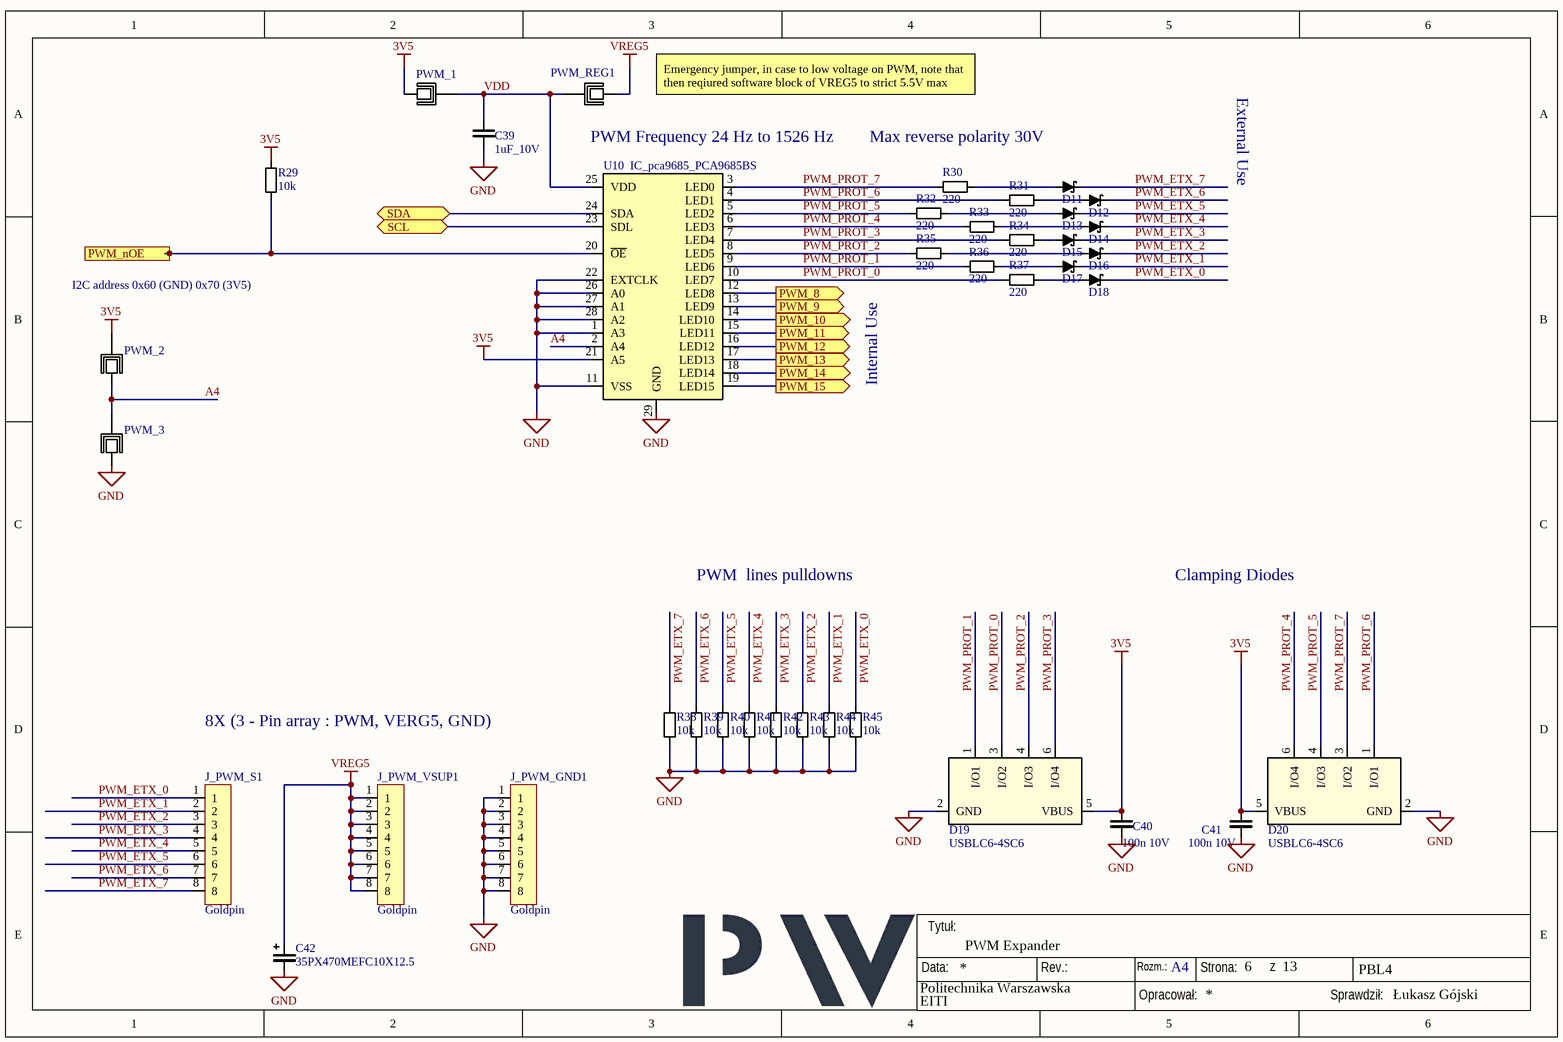
[diagram p9: PWMExpander.SchDoc]

### Parts
C39  1uF_10V  [C_0603]
C40  100n 10V  [C_0603]
C41  100n 10V  [C_0603]
C42  35PX470MEFC10X12.5  [CAP_PKPZ_10X12P5_LOW_RUB]
D11  CUS520,H3F  [SOD2513X115N]  (value not drawn)
D12  CUS520,H3F  [SOD2513X115N]  (value not drawn)
D13  CUS520,H3F  [SOD2513X115N]  (value not drawn)
D14  CUS520,H3F  [SOD2513X115N]  (value not drawn)
D15  CUS520,H3F  [SOD2513X115N]  (value not drawn)
D16  CUS520,H3F  [SOD2513X115N]  (value not drawn)
D17  CUS520,H3F  [SOD2513X115N]  (value not drawn)
D18  CUS520,H3F  [SOD2513X115N]  (value not drawn)
D19  USBLC6-4SC6  [SOT23-6L_STM]
D20  USBLC6-4SC6  [SOT23-6L_STM]
J_PWM_GND1  Goldpin  [goldpin8]
J_PWM_S1  Goldpin  [goldpin8]
J_PWM_VSUP1  Goldpin  [goldpin8]
PWM_1  JUMPER  [Jumper]  (value not drawn)
PWM_2  JUMPER  [Jumper]  (value not drawn)
PWM_3  JUMPER  [Jumper]  (value not drawn)
PWM_REG1  JUMPER  [Jumper]  (value not drawn)
R29  10k  [R_0603]
R30  220  [R_0603]
R31  220  [R_0603]
R32  220  [R_0603]
R33  220  [R_0603]
R34  220  [R_0603]
R35  220  [R_0603]
R36  220  [R_0603]
R37  220  [R_0603]
R38  10k  [R_0603]
R39  10k  [R_0603]
R40  10k  [R_0603]
R41  10k  [R_0603]
R42  10k  [R_0603]
R43  10k  [R_0603]
R44  10k  [R_0603]
R45  10k  [R_0603]
U10  IC_pca9685_PCA9685BS  [PCA9685_SOT788-1]

### Ports
PWM_8 (out, see MainAssembly[4B]), PWM_9 (out, see MainAssembly[4B]), PWM_10 (out, see MainAssembly[4B]), PWM_11 (out, see MainAssembly[4B]), PWM_12 (out, see MainAssembly[4B]), PWM_13 (out, see MainAssembly[4B]), PWM_14 (out, see MainAssembly[4B]), PWM_15 (out, see MainAssembly[4B]), PWM_nOE (in, see MainAssembly[4B]), SCL (bidir, see MainAssembly[3B], ADCHighVoltageInputsSchDoc[2A], DAC[3C], DCDCreg[2C], GPIOExpander[2B], USBPD[4C]), SDA (bidir, see MainAssembly[3B], ADCHighVoltageInputsSchDoc[2A], DAC[3C], DCDCreg[2C], GPIOExpander[2B], USBPD[4C])

### Nets
3V5: C40.2 C41.2 D19.5(VBUS) D20.5(VBUS) PWM_1.1 PWM_2.2 R29.2 U10.21(A5)
GND: C39.1 C40.1 C41.1 C42.2 D19.2(GND) D20.2(GND) J_PWM_GND1.1 J_PWM_GND1.2 J_PWM_GND1.3 J_PWM_GND1.4 J_PWM_GND1.5 J_PWM_GND1.6 J_PWM_GND1.7 J_PWM_GND1.8 PWM_3.1 R38.1 R39.1 R40.1 R41.1 R42.1 R43.1 R44.1 R45.1 U10.1(A3) U10.11(VSS) U10.22(EXTCLK) U10.26(A0) U10.27(A1) U10.28(A2) U10.29(GND)
VREG5: C42.1 J_PWM_VSUP1.1 J_PWM_VSUP1.2 J_PWM_VSUP1.3 J_PWM_VSUP1.4 J_PWM_VSUP1.5 J_PWM_VSUP1.6 J_PWM_VSUP1.7 J_PWM_VSUP1.8 PWM_REG1.1
A4: PWM_2.1 PWM_3.2 U10.2(A4)
DRV_2_EN1: U10.16(LED12) ; port PWM_12
DRV_2_EN2: U10.17(LED13) ; port PWM_13
DRV_2_EN3: U10.18(LED14) ; port PWM_14
DRV_2_EN4: U10.19(LED15) ; port PWM_15
DRV_2_IN1: U10.12(LED8) ; port PWM_8
DRV_2_IN2: U10.13(LED9) ; port PWM_9
DRV_2_IN3: U10.14(LED10) ; port PWM_10
DRV_2_IN4: U10.15(LED11) ; port PWM_11
INTERNAL_I2C_SCL: U10.23(SDL) ; port SCL
INTERNAL_I2C_SDA: U10.24(SDA) ; port SDA
P0: R29.1 U10.20(~{OE}) ; port PWM_nOE
PWM_ETX_0: D18.K J_PWM_S1.1 R45.2
PWM_ETX_1: D17.K J_PWM_S1.2 R44.2
PWM_ETX_2: D16.K J_PWM_S1.3 R43.2
PWM_ETX_3: D15.K J_PWM_S1.4 R42.2
PWM_ETX_4: D14.K J_PWM_S1.5 R41.2
PWM_ETX_5: D13.K J_PWM_S1.6 R40.2
PWM_ETX_6: D12.K J_PWM_S1.7 R39.2
PWM_ETX_7: D11.K J_PWM_S1.8 R38.2
PWM_PROT_0: D19.3(I/O2) R37.1 U10.10(LED7)
PWM_PROT_1: D19.1(I/O1) R36.1 U10.9(LED6)
PWM_PROT_2: D19.4(I/O3) R35.1 U10.8(LED5)
PWM_PROT_3: D19.6(I/O4) R34.1 U10.7(LED4)
PWM_PROT_4: D20.6(I/O4) R33.1 U10.6(LED3)
PWM_PROT_5: D20.4(I/O3) R32.1 U10.5(LED2)
PWM_PROT_6: D20.1(I/O1) R31.1 U10.4(LED1)
PWM_PROT_7: D20.3(I/O2) R30.1 U10.3(LED0)
VDD: C39.2 PWM_1.2 PWM_REG1.2 U10.25(VDD)
NetD11_A: D11.A R30.2
NetD12_A: D12.A R31.2
NetD13_A: D13.A R32.2
NetD14_A: D14.A R33.2
NetD15_A: D15.A R34.2
NetD16_A: D16.A R35.2
NetD17_A: D17.A R36.2
NetD18_A: D18.A R37.2

### Notes on the sheet
- (near PWM_REG1) Emergency jumper, in case to low voltage on PWM, note that then reqiured software block of VREG5 to strict 5.5V max
- PWM Frequency 24 Hz to 1526 Hz
- Max reverse polarity 30V
- External Use
- (near PWM_2) I2C address 0x60 (GND) 0x70 (3V5)
- (near R35) Internal Use
- PWM  lines pulldowns
- Clamping Diodes
- 8X (3 - Pin array : PWM, VERG5, GND)
- Data:
- Tytuł:
- Rev.:
- Rozm.:
- A4
- Strona:
- z
- PBL4
- Opracował:
- Sprawdził:

### Library data of the parts
C39 = C_1uF_10V: as C31 on sheet PowerAssembly; Technology: Ceramic
C40 C41 = C_100nF_10V: as C19 on sheet DCDC3; Value: 100n; Voltage: 10V; Technology: Ceramic
C42 = C_Pol_470uF_35V: as C25 on sheet PowerAssembly
D11-D18 = D schottky 200mA: Schottky Diode 200mA 30V reverse; Power: 150mW; Casing: SOD-323; VFm: 280mV@10mA; Reverse standoff voltage: 30V
D19 D20 = USBLC6-4SC6: Very low capacitance ESD protection; Manufacturer_Name: STMicroelectronics; Copyright: Copyright (C) 2025 Ultra Librarian. All rights reserved.; Manufacturer_Part_Number: USBLC6-4SC6; RefDes: RefDes; Type: Type
J_PWM_GND1 J_PWM_S1 J_PWM_VSUP1 = Goldpin_array_8: Goldpin Male 8
PWM_1-PWM_3 PWM_REG1 = Jumper x2: Jumper on traces
R29 R38-R45 = R_10k: as R75 on sheet PowerAssembly; Value: 10k
R30-R37 = R_220R: Resistor; Tolerance: 1%; Power: 100mW; Casing: 0603; Value: 220